# EAGLE design ROM16word (EAGLE 7.3.0)

## Sheet 1 of 2
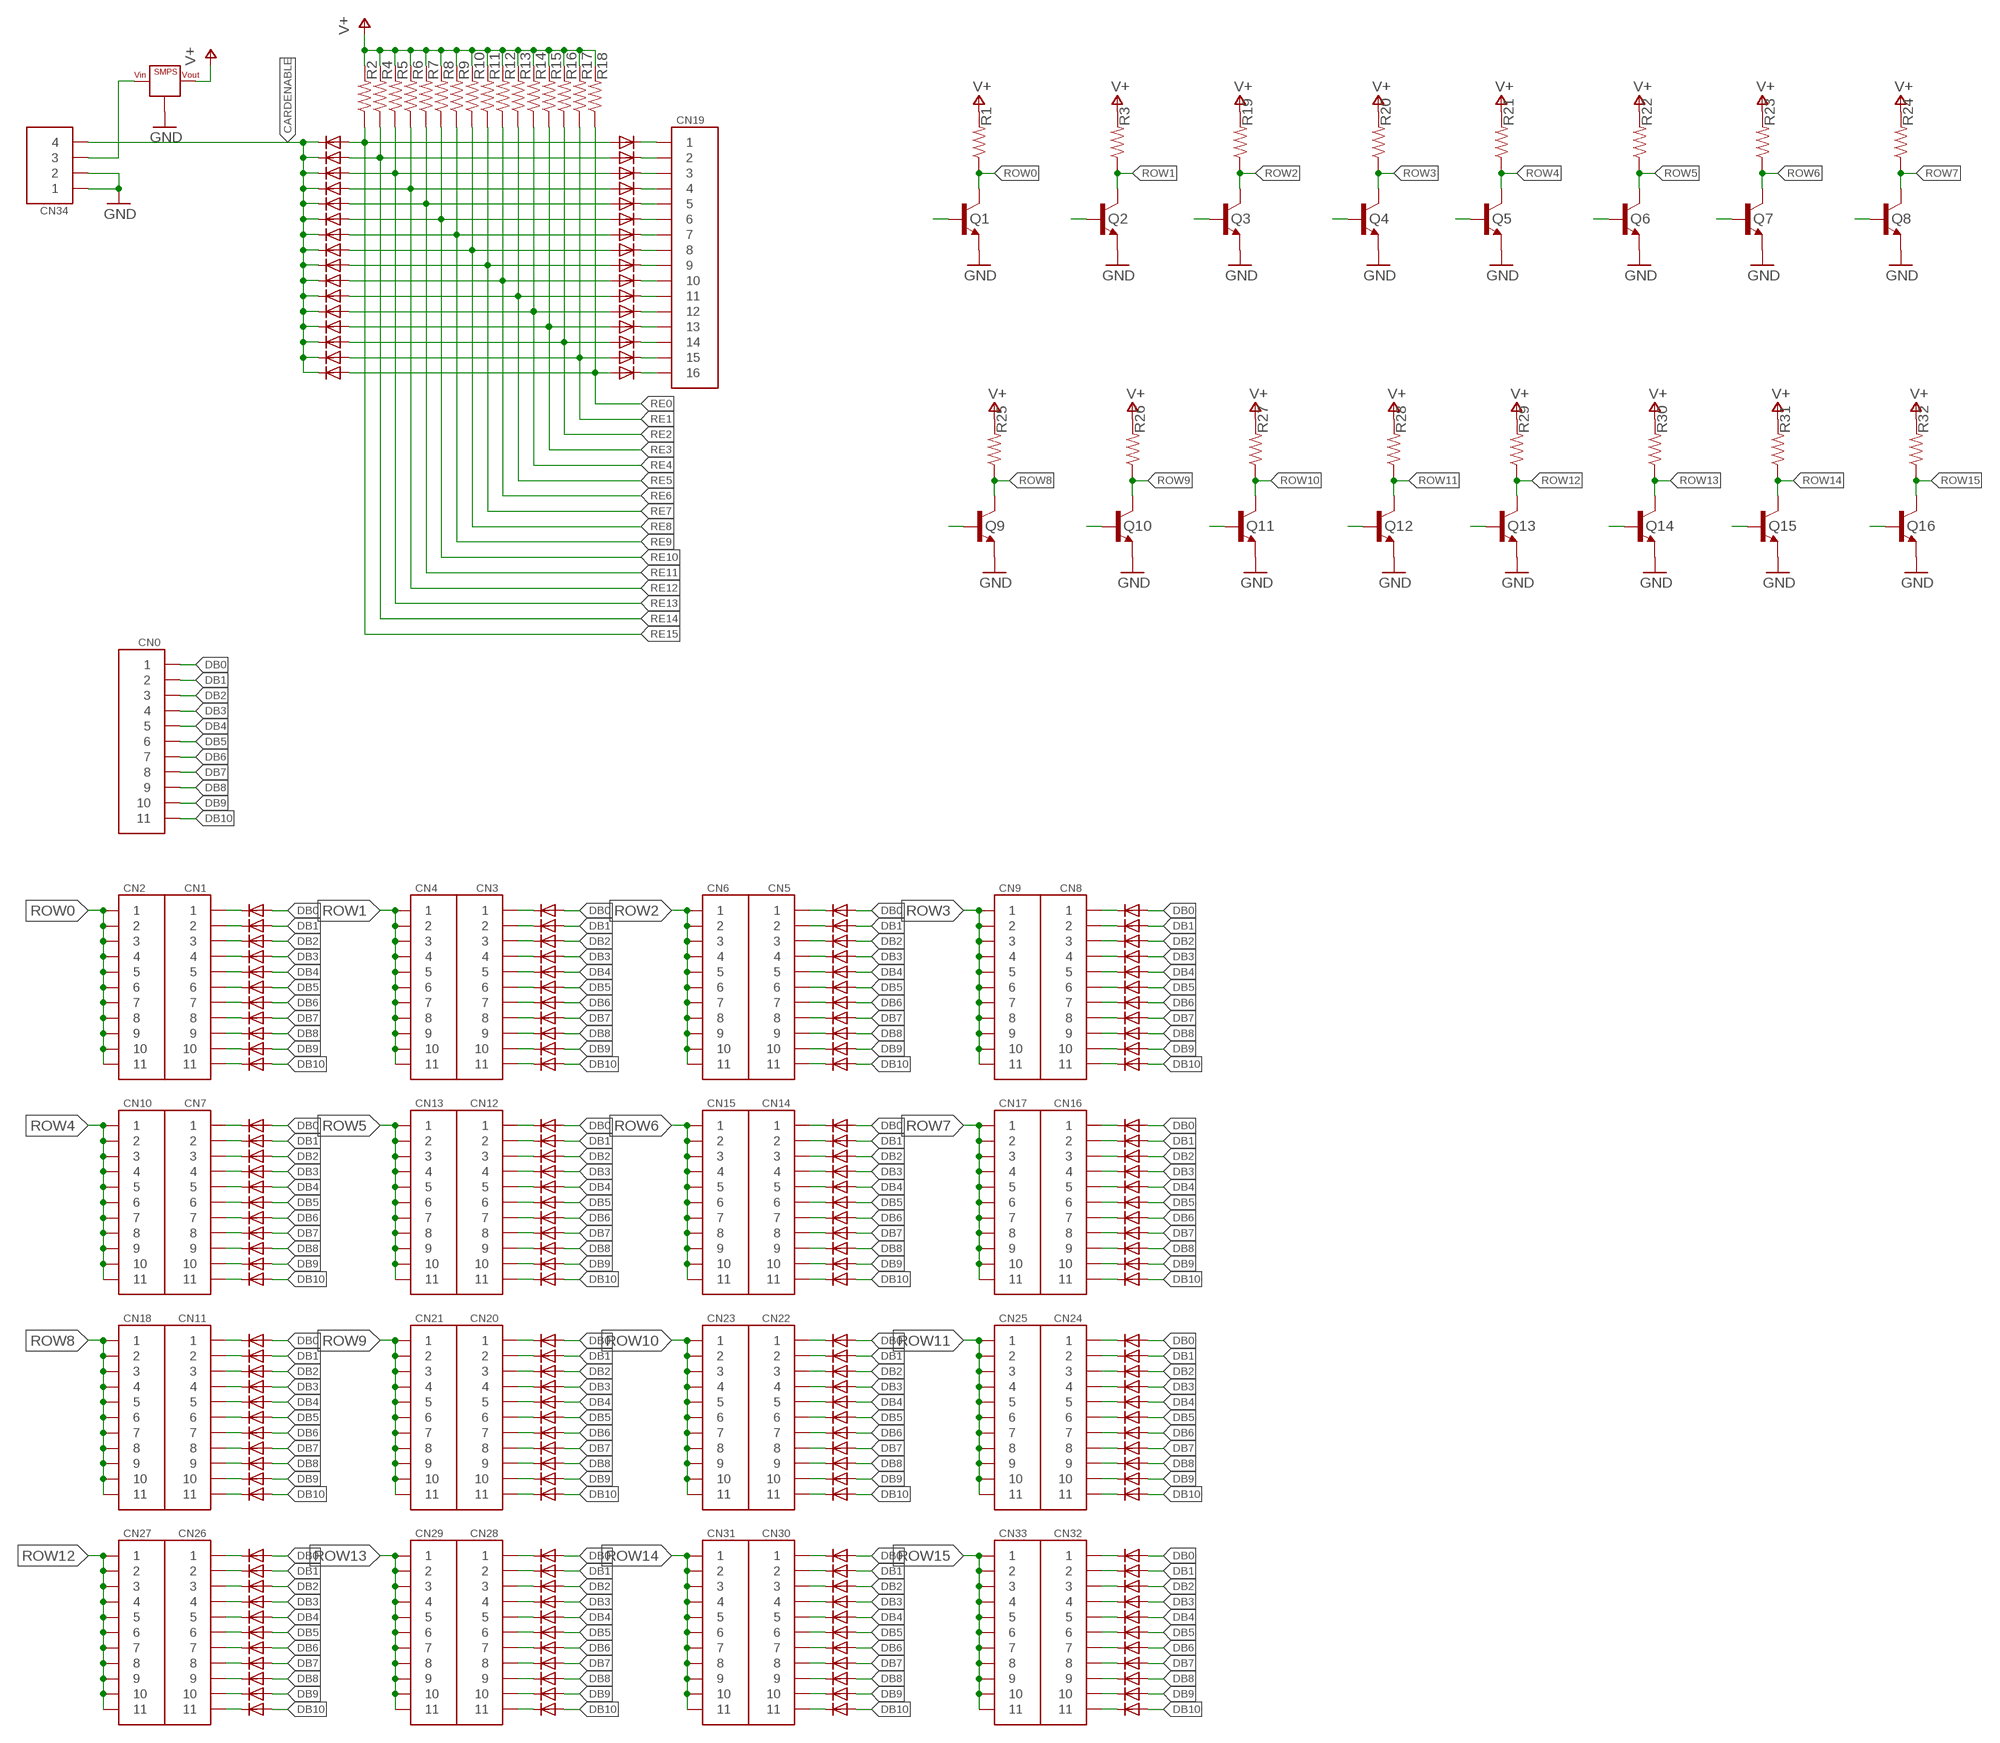
[diagram p0: schematic, sheet 1]

### Parts
CN0  HD11  [HD11]
CN1  HD11  [HD11]
CN2  HD11  [HD11]
CN3  HD11  [HD11]
CN4  HD11  [HD11]
CN5  HD11  [HD11]
CN6  HD11  [HD11]
CN7  HD11  [HD11]
CN8  HD11  [HD11]
CN9  HD11  [HD11]
CN10  HD11  [HD11]
CN11  HD11  [HD11]
CN12  HD11  [HD11]
CN13  HD11  [HD11]
CN14  HD11  [HD11]
CN15  HD11  [HD11]
CN16  HD11  [HD11]
CN17  HD11  [HD11]
CN18  HD11  [HD11]
CN19  HD16  [HD16]
CN20  HD11  [HD11]
CN21  HD11  [HD11]
CN22  HD11  [HD11]
CN23  HD11  [HD11]
CN24  HD11  [HD11]
CN25  HD11  [HD11]
CN26  HD11  [HD11]
CN27  HD11  [HD11]
CN28  HD11  [HD11]
CN29  HD11  [HD11]
CN30  HD11  [HD11]
CN31  HD11  [HD11]
CN32  HD11  [HD11]
CN33  HD11  [HD11]
CN34  HD4  [HD4]
D1  DIODE-6.3  [DO35-6.3]
D2  DIODE-6.3  [DO35-6.3]
D3  DIODE-6.3  [DO35-6.3]
D4  DIODE-6.3  [DO35-6.3]
D5  DIODE-6.3  [DO35-6.3]
D6  DIODE-6.3  [DO35-6.3]
D7  DIODE-6.3  [DO35-6.3]
D8  DIODE-6.3  [DO35-6.3]
D9  DIODE-6.3  [DO35-6.3]
D10  DIODE-6.3  [DO35-6.3]
D11  DIODE-6.3  [DO35-6.3]
D12  DIODE-6.3  [DO35-6.3]
D13  DIODE-6.3  [DO35-6.3]
D14  DIODE-6.3  [DO35-6.3]
D15  DIODE-6.3  [DO35-6.3]
D16  DIODE-6.3  [DO35-6.3]
D17  DIODE-6.3  [DO35-6.3]
D18  DIODE-6.3  [DO35-6.3]
D19  DIODE-6.3  [DO35-6.3]
D20  DIODE-6.3  [DO35-6.3]
D21  DIODE-6.3  [DO35-6.3]
D22  DIODE-6.3  [DO35-6.3]
D23  DIODE-6.3  [DO35-6.3]
D24  DIODE-6.3  [DO35-6.3]
D25  DIODE-6.3  [DO35-6.3]
D26  DIODE-6.3  [DO35-6.3]
D27  DIODE-6.3  [DO35-6.3]
D28  DIODE-6.3  [DO35-6.3]
D29  DIODE-6.3  [DO35-6.3]
D30  DIODE-6.3  [DO35-6.3]
D31  DIODE-6.3  [DO35-6.3]
D32  DIODE-6.3  [DO35-6.3]
D33  DIODE-6.3  [DO35-6.3]
D34  DIODE-6.3  [DO35-6.3]
D35  DIODE-6.3  [DO35-6.3]
D36  DIODE-6.3  [DO35-6.3]
D37  DIODE-6.3  [DO35-6.3]
D38  DIODE-6.3  [DO35-6.3]
D39  DIODE-6.3  [DO35-6.3]
D40  DIODE-6.3  [DO35-6.3]
D41  DIODE-6.3  [DO35-6.3]
D42  DIODE-6.3  [DO35-6.3]
D43  DIODE-6.3  [DO35-6.3]
D44  DIODE-6.3  [DO35-6.3]
D45  DIODE-6.3  [DO35-6.3]
D46  DIODE-6.3  [DO35-6.3]
D47  DIODE-6.3  [DO35-6.3]
D48  DIODE-6.3  [DO35-6.3]
D49  DIODE-6.3  [DO35-6.3]
D50  DIODE-6.3  [DO35-6.3]
D51  DIODE-6.3  [DO35-6.3]
D52  DIODE-6.3  [DO35-6.3]
D53  DIODE-6.3  [DO35-6.3]
D54  DIODE-6.3  [DO35-6.3]
D55  DIODE-6.3  [DO35-6.3]
D56  DIODE-6.3  [DO35-6.3]
D57  DIODE-6.3  [DO35-6.3]
D58  DIODE-6.3  [DO35-6.3]
D59  DIODE-6.3  [DO35-6.3]
D60  DIODE-6.3  [DO35-6.3]
D61  DIODE-6.3  [DO35-6.3]
D62  DIODE-6.3  [DO35-6.3]
D63  DIODE-6.3  [DO35-6.3]
D64  DIODE-6.3  [DO35-6.3]
D65  DIODE-6.3  [DO35-6.3]
D66  DIODE-6.3  [DO35-6.3]
D67  DIODE-6.3  [DO35-6.3]
D68  DIODE-6.3  [DO35-6.3]
D69  DIODE-6.3  [DO35-6.3]
D70  DIODE-6.3  [DO35-6.3]
D71  DIODE-6.3  [DO35-6.3]
D72  DIODE-6.3  [DO35-6.3]
D73  DIODE-6.3  [DO35-6.3]
D74  DIODE-6.3  [DO35-6.3]
D75  DIODE-6.3  [DO35-6.3]
D76  DIODE-6.3  [DO35-6.3]
D77  DIODE-6.3  [DO35-6.3]
D78  DIODE-6.3  [DO35-6.3]
D79  DIODE-6.3  [DO35-6.3]
D80  DIODE-6.3  [DO35-6.3]
D81  DIODE-6.3  [DO35-6.3]
D82  DIODE-6.3  [DO35-6.3]
D83  DIODE-6.3  [DO35-6.3]
D84  DIODE-6.3  [DO35-6.3]
D85  DIODE-6.3  [DO35-6.3]
D86  DIODE-6.3  [DO35-6.3]
D87  DIODE-6.3  [DO35-6.3]
D88  DIODE-6.3  [DO35-6.3]
D89  DIODE-6.3  [DO35-6.3]
D90  DIODE-6.3  [DO35-6.3]
D91  DIODE-6.3  [DO35-6.3]
D92  DIODE-6.3  [DO35-6.3]
D93  DIODE-6.3  [DO35-6.3]
D94  DIODE-6.3  [DO35-6.3]
D95  DIODE-6.3  [DO35-6.3]
D96  DIODE-6.3  [DO35-6.3]
D97  DIODE-6.3  [DO35-6.3]
D98  DIODE-6.3  [DO35-6.3]
D99  DIODE-6.3  [DO35-6.3]
D100  DIODE-6.3  [DO35-6.3]
D101  DIODE-6.3  [DO35-6.3]
D102  DIODE-6.3  [DO35-6.3]
D103  DIODE-6.3  [DO35-6.3]
D104  DIODE-6.3  [DO35-6.3]
D105  DIODE-6.3  [DO35-6.3]
D106  DIODE-6.3  [DO35-6.3]
D107  DIODE-6.3  [DO35-6.3]
D108  DIODE-6.3  [DO35-6.3]
D109  DIODE-6.3  [DO35-6.3]
D110  DIODE-6.3  [DO35-6.3]
D111  DIODE-6.3  [DO35-6.3]
D112  DIODE-6.3  [DO35-6.3]
D113  DIODE-6.3  [DO35-6.3]
D114  DIODE-6.3  [DO35-6.3]
D115  DIODE-6.3  [DO35-6.3]
D116  DIODE-6.3  [DO35-6.3]
D117  DIODE-6.3  [DO35-6.3]
D118  DIODE-6.3  [DO35-6.3]
D119  DIODE-6.3  [DO35-6.3]
D120  DIODE-6.3  [DO35-6.3]
D121  DIODE-6.3  [DO35-6.3]
D122  DIODE-6.3  [DO35-6.3]
D123  DIODE-6.3  [DO35-6.3]
D124  DIODE-6.3  [DO35-6.3]
D125  DIODE-6.3  [DO35-6.3]
D126  DIODE-6.3  [DO35-6.3]
D127  DIODE-6.3  [DO35-6.3]
D128  DIODE-6.3  [DO35-6.3]
D129  DIODE-6.3  [DO35-6.3]
D130  DIODE-6.3  [DO35-6.3]
D131  DIODE-6.3  [DO35-6.3]
D132  DIODE-6.3  [DO35-6.3]
D133  DIODE-6.3  [DO35-6.3]
D134  DIODE-6.3  [DO35-6.3]
D135  DIODE-6.3  [DO35-6.3]
D136  DIODE-6.3  [DO35-6.3]
D137  DIODE-6.3  [DO35-6.3]
D138  DIODE-6.3  [DO35-6.3]
D139  DIODE-6.3  [DO35-6.3]
D140  DIODE-6.3  [DO35-6.3]
D141  DIODE-6.3  [DO35-6.3]
D142  DIODE-6.3  [DO35-6.3]
D143  DIODE-6.3  [DO35-6.3]
D144  DIODE-6.3  [DO35-6.3]
D145  DIODE-6.3  [DO35-6.3]
D146  DIODE-6.3  [DO35-6.3]
D147  DIODE-6.3  [DO35-6.3]
D148  DIODE-6.3  [DO35-6.3]
D149  DIODE-6.3  [DO35-6.3]
D150  DIODE-6.3  [DO35-6.3]
D151  DIODE-6.3  [DO35-6.3]
D152  DIODE-6.3  [DO35-6.3]
D153  DIODE-6.3  [DO35-6.3]
D154  DIODE-6.3  [DO35-6.3]
D155  DIODE-6.3  [DO35-6.3]
D156  DIODE-6.3  [DO35-6.3]
D157  DIODE-6.3  [DO35-6.3]
D158  DIODE-6.3  [DO35-6.3]
D159  DIODE-6.3  [DO35-6.3]
D160  DIODE-6.3  [DO35-6.3]
D161  DIODE-6.3  [DO35-6.3]
D162  DIODE-6.3  [DO35-6.3]
D163  DIODE-6.3  [DO35-6.3]
D164  DIODE-6.3  [DO35-6.3]
D165  DIODE-6.3  [DO35-6.3]
D166  DIODE-6.3  [DO35-6.3]
D167  DIODE-6.3  [DO35-6.3]
D168  DIODE-6.3  [DO35-6.3]
D169  DIODE-6.3  [DO35-6.3]
D170  DIODE-6.3  [DO35-6.3]
D171  DIODE-6.3  [DO35-6.3]
D172  DIODE-6.3  [DO35-6.3]
D173  DIODE-6.3  [DO35-6.3]
D174  DIODE-6.3  [DO35-6.3]
D175  DIODE-6.3  [DO35-6.3]
D176  DIODE-6.3  [DO35-6.3]
D177  DIODE-5.08  [DO35-5.08]
D178  DIODE-5.08  [DO35-5.08]
D179  DIODE-5.08  [DO35-5.08]
D180  DIODE-5.08  [DO35-5.08]
D181  DIODE-5.08  [DO35-5.08]
D182  DIODE-5.08  [DO35-5.08]
D183  DIODE-5.08  [DO35-5.08]
D184  DIODE-5.08  [DO35-5.08]
D185  DIODE-5.08  [DO35-5.08]
D186  DIODE-5.08  [DO35-5.08]
D187  DIODE-5.08  [DO35-5.08]
D188  DIODE-5.08  [DO35-5.08]
D189  DIODE-5.08  [DO35-5.08]
D190  DIODE-5.08  [DO35-5.08]
D191  DIODE-5.08  [DO35-5.08]
D192  DIODE-5.08  [DO35-5.08]
D193  DIODE-5.08  [DO35-5.08]
D194  DIODE-5.08  [DO35-5.08]
D195  DIODE-5.08  [DO35-5.08]
D196  DIODE-5.08  [DO35-5.08]
D197  DIODE-5.08  [DO35-5.08]
D198  DIODE-5.08  [DO35-5.08]
D199  DIODE-5.08  [DO35-5.08]
D200  DIODE-5.08  [DO35-5.08]
D201  DIODE-5.08  [DO35-5.08]
D202  DIODE-5.08  [DO35-5.08]
D203  DIODE-5.08  [DO35-5.08]
D204  DIODE-5.08  [DO35-5.08]
D205  DIODE-5.08  [DO35-5.08]
D206  DIODE-5.08  [DO35-5.08]
D207  DIODE-5.08  [DO35-5.08]
D208  DIODE-5.08  [DO35-5.08]
Q1  BC547-STRAIGHT  [TO92-S-CBE]
Q2  BC547-STRAIGHT  [TO92-S-CBE]
Q3  BC547-STRAIGHT  [TO92-S-CBE]
Q4  BC547-STRAIGHT  [TO92-S-CBE]
Q5  BC547-STRAIGHT  [TO92-S-CBE]
Q6  BC547-STRAIGHT  [TO92-S-CBE]
Q7  BC547-STRAIGHT  [TO92-S-CBE]
Q8  BC547-STRAIGHT  [TO92-S-CBE]
Q9  BC547-STRAIGHT  [TO92-S-CBE]
Q10  BC547-STRAIGHT  [TO92-S-CBE]
Q11  BC547-STRAIGHT  [TO92-S-CBE]
Q12  BC547-STRAIGHT  [TO92-S-CBE]
Q13  BC547-STRAIGHT  [TO92-S-CBE]
Q14  BC547-STRAIGHT  [TO92-S-CBE]
Q15  BC547-STRAIGHT  [TO92-S-CBE]
Q16  BC547-STRAIGHT  [TO92-S-CBE]
R1  R1/8-6MM  [R0125-6.3]
R2  R1/8-6MM  [R0125-6.3]
R3  R1/8-6MM  [R0125-6.3]
R4  R1/8-6MM  [R0125-6.3]
R5  R1/8-6MM  [R0125-6.3]
R6  R1/8-6MM  [R0125-6.3]
R7  R1/8-6MM  [R0125-6.3]
R8  R1/8-6MM  [R0125-6.3]
R9  R1/8-6MM  [R0125-6.3]
R10  R1/8-6MM  [R0125-6.3]
R11  R1/8-6MM  [R0125-6.3]
R12  R1/8-6MM  [R0125-6.3]
R13  R1/8-6MM  [R0125-6.3]
R14  R1/8-6MM  [R0125-6.3]
R15  R1/8-6MM  [R0125-6.3]
R16  R1/8-6MM  [R0125-6.3]
R17  R1/8-6MM  [R0125-6.3]
R18  R1/8-6MM  [R0125-6.3]
R19  R1/8-6MM  [R0125-6.3]
R20  R1/8-6MM  [R0125-6.3]
R21  R1/8-6MM  [R0125-6.3]
R22  R1/8-6MM  [R0125-6.3]
R23  R1/8-6MM  [R0125-6.3]
R24  R1/8-6MM  [R0125-6.3]
R25  R1/8-6MM  [R0125-6.3]
R26  R1/8-6MM  [R0125-6.3]
R27  R1/8-6MM  [R0125-6.3]
R28  R1/8-6MM  [R0125-6.3]
R29  R1/8-6MM  [R0125-6.3]
R30  R1/8-6MM  [R0125-6.3]
R31  R1/8-6MM  [R0125-6.3]
R32  R1/8-6MM  [R0125-6.3]
VR1  SMPS  [BUCK1722]

### Nets
CARDENABLE: CN34.P$4 D182.C D183.C D184.C D185.C D186.C D187.C D188.C D189.C D190.C D191.C D192.C D193.C D194.C D195.C D196.C D197.C
DB0: CN0.P$1 D1.A D12.A D23.A D34.A D45.A D56.A D67.A D78.A D89.A D100.A D111.A D122.A D133.A D144.A D155.A D166.A
DB1: CN0.P$2 D2.A D13.A D24.A D35.A D46.A D57.A D68.A D79.A D90.A D101.A D112.A D123.A D134.A D145.A D156.A D167.A
DB2: CN0.P$3 D3.A D14.A D25.A D36.A D47.A D58.A D69.A D80.A D91.A D102.A D113.A D124.A D135.A D146.A D157.A D168.A
DB3: CN0.P$4 D4.A D15.A D26.A D37.A D48.A D59.A D70.A D81.A D92.A D103.A D114.A D125.A D136.A D147.A D158.A D169.A
DB4: CN0.P$5 D5.A D16.A D27.A D38.A D49.A D60.A D71.A D82.A D93.A D104.A D115.A D126.A D137.A D148.A D159.A D170.A
DB5: CN0.P$6 D6.A D17.A D28.A D39.A D50.A D61.A D72.A D83.A D94.A D105.A D116.A D127.A D138.A D149.A D160.A D171.A
DB6: CN0.P$7 D7.A D18.A D29.A D40.A D51.A D62.A D73.A D84.A D95.A D106.A D117.A D128.A D139.A D150.A D161.A D172.A
DB7: CN0.P$8 D8.A D19.A D30.A D41.A D52.A D63.A D74.A D85.A D96.A D107.A D118.A D129.A D140.A D151.A D162.A D173.A
DB8: CN0.P$9 D9.A D20.A D31.A D42.A D53.A D64.A D75.A D86.A D97.A D108.A D119.A D130.A D141.A D152.A D163.A D174.A
DB9: CN0.P$10 D10.A D21.A D32.A D43.A D54.A D65.A D76.A D87.A D98.A D109.A D120.A D131.A D142.A D153.A D164.A D175.A
DB10: CN0.P$11 D11.A D22.A D33.A D44.A D55.A D66.A D77.A D88.A D99.A D110.A D121.A D132.A D143.A D154.A D165.A D176.A
GND: CN34.P$1 CN34.P$2 Q1.E Q2.E Q3.E Q4.E Q5.E Q6.E Q7.E Q8.E Q9.E Q10.E Q11.E Q12.E Q13.E Q14.E Q15.E Q16.E VR1.GND@1(GND) VR1.GND@2(GND) VR1.GND@3(GND) VR1.GND@4(GND)
N$1: CN1.P$1 D1.C
N$2: CN1.P$2 D2.C
N$3: CN1.P$3 D3.C
N$4: CN1.P$4 D4.C
N$5: CN1.P$5 D5.C
N$6: CN1.P$6 D6.C
N$7: CN1.P$7 D7.C
N$8: CN1.P$8 D8.C
N$9: CN1.P$9 D9.C
N$10: CN1.P$10 D10.C
N$11: CN1.P$11 D11.C
N$12: CN3.P$1 D12.C
N$13: CN3.P$2 D13.C
N$14: CN3.P$3 D14.C
N$15: CN3.P$4 D15.C
N$16: CN3.P$5 D16.C
N$17: CN3.P$6 D17.C
N$18: CN3.P$7 D18.C
N$19: CN3.P$8 D19.C
N$20: CN3.P$9 D20.C
N$21: CN3.P$10 D21.C
N$22: CN3.P$11 D22.C
N$23: CN5.P$1 D23.C
N$24: CN5.P$2 D24.C
N$25: CN5.P$3 D25.C
N$26: CN5.P$4 D26.C
N$27: CN5.P$5 D27.C
N$28: CN5.P$6 D28.C
N$29: CN5.P$7 D29.C
N$30: CN5.P$8 D30.C
N$31: CN5.P$9 D31.C
N$32: CN5.P$10 D32.C
N$33: CN5.P$11 D33.C
N$34: CN8.P$1 D34.C
N$35: CN8.P$2 D35.C
N$36: CN8.P$3 D36.C
N$37: CN8.P$4 D37.C
N$38: CN8.P$5 D38.C
N$39: CN8.P$6 D39.C
N$40: CN8.P$7 D40.C
N$41: CN8.P$8 D41.C
N$42: CN8.P$9 D42.C
N$43: CN8.P$10 D43.C
N$44: CN8.P$11 D44.C
N$45: CN7.P$1 D45.C
N$46: CN7.P$2 D46.C
N$47: CN7.P$3 D47.C
N$48: CN7.P$4 D48.C
N$49: CN7.P$5 D49.C
N$50: CN7.P$6 D50.C
N$51: CN7.P$7 D51.C
N$52: CN7.P$8 D52.C
N$53: CN7.P$9 D53.C
N$54: CN7.P$10 D54.C
N$55: CN7.P$11 D55.C
N$56: CN12.P$1 D56.C
N$57: CN12.P$2 D57.C
N$58: CN12.P$3 D58.C
N$59: CN12.P$4 D59.C
N$60: CN12.P$5 D60.C
N$61: CN12.P$6 D61.C
N$62: CN12.P$7 D62.C
N$63: CN12.P$8 D63.C
N$64: CN12.P$9 D64.C
N$65: CN12.P$10 D65.C
N$66: CN12.P$11 D66.C
N$67: CN14.P$1 D67.C
N$68: CN14.P$2 D68.C
N$69: CN14.P$3 D69.C
N$70: CN14.P$4 D70.C
N$71: CN14.P$5 D71.C
N$72: CN14.P$6 D72.C
N$73: CN14.P$7 D73.C
N$74: CN14.P$8 D74.C
N$75: CN14.P$9 D75.C
N$76: CN14.P$10 D76.C
N$77: CN14.P$11 D77.C
N$78: CN16.P$1 D78.C
N$79: CN16.P$2 D79.C
N$80: CN16.P$3 D80.C
N$81: CN16.P$4 D81.C
N$82: CN16.P$5 D82.C
N$83: CN16.P$6 D83.C
N$84: CN16.P$7 D84.C
N$85: CN16.P$8 D85.C
N$86: CN16.P$9 D86.C
N$87: CN16.P$10 D87.C
N$88: CN16.P$11 D88.C
N$89: CN11.P$1 D89.C
N$90: CN11.P$2 D90.C
N$91: CN11.P$3 D91.C
N$92: CN11.P$4 D92.C
N$93: CN11.P$5 D93.C
N$94: CN11.P$6 D94.C
N$95: CN11.P$7 D95.C
N$96: CN11.P$8 D96.C
N$97: CN11.P$9 D97.C
N$98: CN11.P$10 D98.C
N$99: CN11.P$11 D99.C
N$100: CN20.P$1 D100.C
N$101: CN20.P$2 D101.C
N$102: CN20.P$3 D102.C
N$103: CN20.P$4 D103.C
N$104: CN20.P$5 D104.C
N$105: CN20.P$6 D105.C
N$106: CN20.P$7 D106.C
N$107: CN20.P$8 D107.C
N$108: CN20.P$9 D108.C
N$109: CN20.P$10 D109.C
N$110: CN20.P$11 D110.C
N$111: CN22.P$1 D111.C
N$112: CN22.P$2 D112.C
N$113: CN22.P$3 D113.C
N$114: CN22.P$4 D114.C
N$115: CN22.P$5 D115.C
N$116: CN22.P$6 D116.C
N$117: CN22.P$7 D117.C
N$118: CN22.P$8 D118.C
N$119: CN22.P$9 D119.C
N$120: CN22.P$10 D120.C
N$121: CN22.P$11 D121.C
N$122: CN24.P$1 D122.C
N$123: CN24.P$2 D123.C
N$124: CN24.P$3 D124.C
N$125: CN24.P$4 D125.C
N$126: CN24.P$5 D126.C
N$127: CN24.P$6 D127.C
N$128: CN24.P$7 D128.C
N$129: CN24.P$8 D129.C
N$130: CN24.P$9 D130.C
N$131: CN24.P$10 D131.C
N$132: CN24.P$11 D132.C
N$133: CN26.P$1 D133.C
N$134: CN26.P$2 D134.C
N$135: CN26.P$3 D135.C
N$136: CN26.P$4 D136.C
N$137: CN26.P$5 D137.C
N$138: CN26.P$6 D138.C
N$139: CN26.P$7 D139.C
N$140: CN26.P$8 D140.C
N$141: CN26.P$9 D141.C
N$142: CN26.P$10 D142.C
N$143: CN26.P$11 D143.C
N$144: CN28.P$1 D144.C
N$145: CN28.P$2 D145.C
N$146: CN28.P$3 D146.C
N$147: CN28.P$4 D147.C
N$148: CN28.P$5 D148.C
N$149: CN28.P$6 D149.C
N$150: CN28.P$7 D150.C
N$151: CN28.P$8 D151.C
N$152: CN28.P$9 D152.C
N$153: CN28.P$10 D153.C
N$154: CN28.P$11 D154.C
N$155: CN30.P$1 D155.C
N$156: CN30.P$2 D156.C
N$157: CN30.P$3 D157.C
N$158: CN30.P$4 D158.C
N$159: CN30.P$5 D159.C
N$160: CN30.P$6 D160.C
N$161: CN30.P$7 D161.C
N$162: CN30.P$8 D162.C
N$163: CN30.P$9 D163.C
N$164: CN30.P$10 D164.C
N$165: CN30.P$11 D165.C
N$166: CN32.P$1 D166.C
N$167: CN32.P$2 D167.C
N$168: CN32.P$3 D168.C
N$169: CN32.P$4 D169.C
N$170: CN32.P$5 D170.C
N$171: CN32.P$6 D171.C
N$172: CN32.P$7 D172.C
N$173: CN32.P$8 D173.C
N$174: CN32.P$9 D174.C
N$175: CN32.P$10 D175.C
N$176: CN32.P$11 D176.C
N$177: Q2.B
N$178: Q1.B
N$179: Q3.B
N$180: Q4.B
N$181: Q5.B
N$182: Q6.B
N$183: Q7.B
N$184: Q8.B
N$185: Q9.B
N$186: Q10.B
N$187: Q11.B
N$188: Q12.B
N$189: Q13.B
N$190: Q14.B
N$191: Q15.B
N$192: Q16.B
POW: CN34.P$3 VR1.IN@1(VIN) VR1.IN@2(VIN)
RE0: D197.A D208.A R18.1
RE1: D196.A D207.A R17.1
RE2: D195.A D206.A R16.1
RE3: D194.A D205.A R15.1
RE4: D193.A D204.A R14.1
RE5: D192.A D203.A R13.1
RE6: D191.A D202.A R12.1
RE7: D190.A D201.A R11.1
RE8: D189.A D200.A R10.1
RE9: D188.A D199.A R9.1
RE10: D187.A D198.A R8.1
RE11: D181.A D186.A R7.1
RE12: D180.A D185.A R6.1
RE13: D179.A D184.A R5.1
RE14: D178.A D183.A R4.1
RE15: D177.A D182.A R2.1
ROW0: CN2.P$1 CN2.P$2 CN2.P$3 CN2.P$4 CN2.P$5 CN2.P$6 CN2.P$7 CN2.P$8 CN2.P$9 CN2.P$10 CN2.P$11 Q1.C R1.1
ROW1: CN4.P$1 CN4.P$2 CN4.P$3 CN4.P$4 CN4.P$5 CN4.P$6 CN4.P$7 CN4.P$8 CN4.P$9 CN4.P$10 CN4.P$11 Q2.C R3.1
ROW2: CN6.P$1 CN6.P$2 CN6.P$3 CN6.P$4 CN6.P$5 CN6.P$6 CN6.P$7 CN6.P$8 CN6.P$9 CN6.P$10 CN6.P$11 Q3.C R19.1
ROW3: CN9.P$1 CN9.P$2 CN9.P$3 CN9.P$4 CN9.P$5 CN9.P$6 CN9.P$7 CN9.P$8 CN9.P$9 CN9.P$10 CN9.P$11 Q4.C R20.1
ROW4: CN10.P$1 CN10.P$2 CN10.P$3 CN10.P$4 CN10.P$5 CN10.P$6 CN10.P$7 CN10.P$8 CN10.P$9 CN10.P$10 CN10.P$11 Q5.C R21.1
ROW5: CN13.P$1 CN13.P$2 CN13.P$3 CN13.P$4 CN13.P$5 CN13.P$6 CN13.P$7 CN13.P$8 CN13.P$9 CN13.P$10 CN13.P$11 Q6.C R22.1
ROW6: CN15.P$1 CN15.P$2 CN15.P$3 CN15.P$4 CN15.P$5 CN15.P$6 CN15.P$7 CN15.P$8 CN15.P$9 CN15.P$10 CN15.P$11 Q7.C R23.1
ROW7: CN17.P$1 CN17.P$2 CN17.P$3 CN17.P$4 CN17.P$5 CN17.P$6 CN17.P$7 CN17.P$8 CN17.P$9 CN17.P$10 CN17.P$11 Q8.C R24.1
ROW8: CN18.P$1 CN18.P$2 CN18.P$3 CN18.P$4 CN18.P$5 CN18.P$6 CN18.P$7 CN18.P$8 CN18.P$9 CN18.P$10 CN18.P$11 Q9.C R25.1
ROW9: CN21.P$1 CN21.P$2 CN21.P$3 CN21.P$4 CN21.P$5 CN21.P$6 CN21.P$7 CN21.P$8 CN21.P$9 CN21.P$10 CN21.P$11 Q10.C R26.1
ROW10: CN23.P$1 CN23.P$2 CN23.P$3 CN23.P$4 CN23.P$5 CN23.P$6 CN23.P$7 CN23.P$8 CN23.P$9 CN23.P$10 CN23.P$11 Q11.C R27.1
ROW11: CN25.P$1 CN25.P$2 CN25.P$3 CN25.P$4 CN25.P$5 CN25.P$6 CN25.P$7 CN25.P$8 CN25.P$9 CN25.P$10 CN25.P$11 Q12.C R28.1
ROW12: CN27.P$1 CN27.P$2 CN27.P$3 CN27.P$4 CN27.P$5 CN27.P$6 CN27.P$7 CN27.P$8 CN27.P$9 CN27.P$10 CN27.P$11 Q13.C R29.1
ROW13: CN29.P$1 CN29.P$2 CN29.P$3 CN29.P$4 CN29.P$5 CN29.P$6 CN29.P$7 CN29.P$8 CN29.P$9 CN29.P$10 CN29.P$11 Q14.C R30.1
ROW14: CN31.P$1 CN31.P$2 CN31.P$3 CN31.P$4 CN31.P$5 CN31.P$6 CN31.P$7 CN31.P$8 CN31.P$9 CN31.P$10 CN31.P$11 Q15.C R31.1
ROW15: CN33.P$1 CN33.P$2 CN33.P$3 CN33.P$4 CN33.P$5 CN33.P$6 CN33.P$7 CN33.P$8 CN33.P$9 CN33.P$10 CN33.P$11 Q16.C R32.1
SEL0: CN19.P$1 D177.C
SEL1: CN19.P$2 D178.C
SEL2: CN19.P$3 D179.C
SEL3: CN19.P$4 D180.C
SEL4: CN19.P$5 D181.C
SEL5: CN19.P$6 D198.C
SEL6: CN19.P$7 D199.C
SEL7: CN19.P$8 D200.C
SEL8: CN19.P$9 D201.C
SEL9: CN19.P$10 D202.C
SEL10: CN19.P$11 D203.C
SEL11: CN19.P$12 D204.C
SEL12: CN19.P$13 D205.C
SEL13: CN19.P$14 D206.C
SEL14: CN19.P$15 D207.C
SEL15: CN19.P$16 D208.C
V+: R1.2 R2.2 R3.2 R4.2 R5.2 R6.2 R7.2 R8.2 R9.2 R10.2 R11.2 R12.2 R13.2 R14.2 R15.2 R16.2 R17.2 R18.2 R19.2 R20.2 R21.2 R22.2 R23.2 R24.2 R25.2 R26.2 R27.2 R28.2 R29.2 R30.2 R31.2 R32.2 VR1.OUT@1(VOUT) VR1.OUT@2(VOUT)

## Sheet 2 of 2

## Library data of the parts
CN0 CN1-CN18 CN20-CN33 = SmallRoomLabs_ConSwitch:HD11
CN19 = SmallRoomLabs_ConSwitch:HD16
CN34 = SmallRoomLabs_ConSwitch:HD4
D1-D208 = SmallRoomLabs_Semiconductor:DIODE
Q1-Q16 = SmallRoomLabs_Semiconductor:BC547
R1-R32 = SmallRoomLabs_Discrete:R
VR1 = SmallRoomLabs_Battery:SMPS

## Board
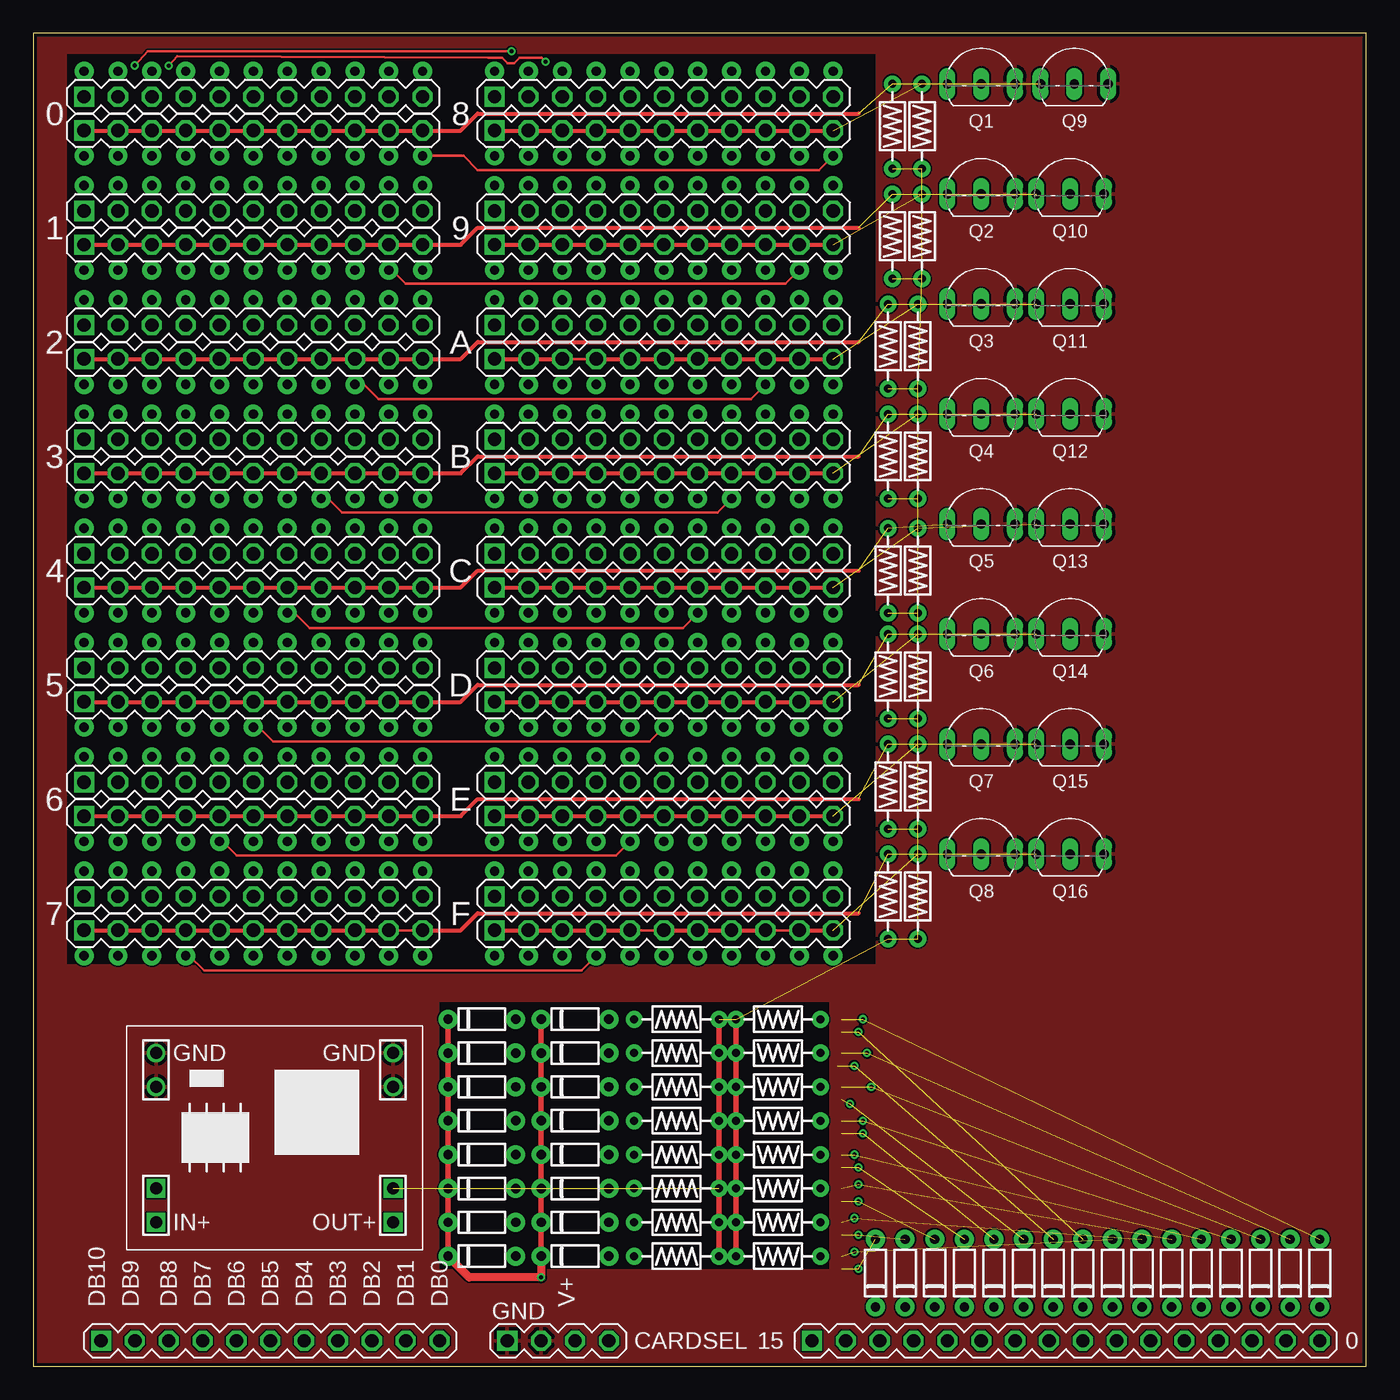
[diagram p1: board, top side]
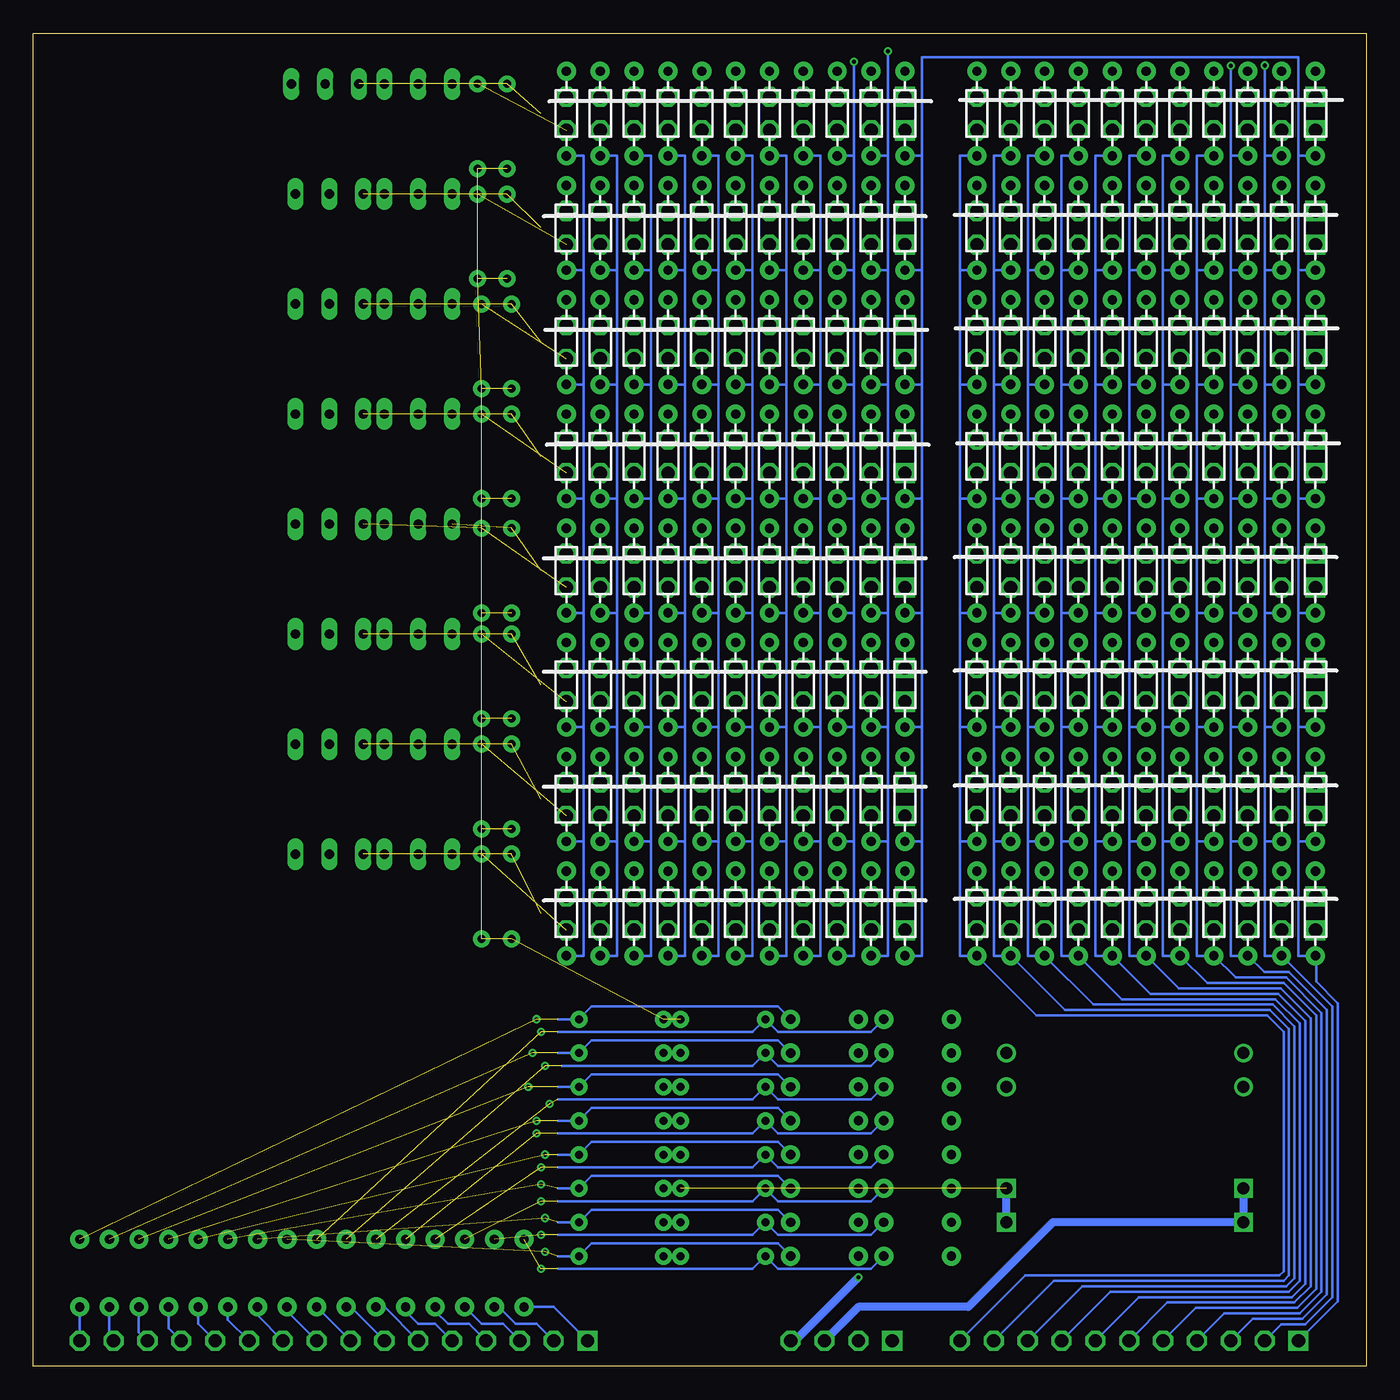
[diagram p2: board, bottom side, seen from below]

Size 100 x 100 mm. Coordinates in mm from the lower left corner, seen from the top.
Outline: 0,0 100,0 100,100 0,100 0,0
Copper layers (1*16): Top 0.035mm / dielectric 1.5mm / Bottom 0.035mm
Design rules "dirt_cheap_dirty_boards.v1": minimum track width 5mil, minimum drill 12mil, track to track 5mil, track to pad 5mil, pad to pad 5mil, via to via 5mil, smd to smd 0mil, copper to edge 10mil, drill to drill 10mil, minimum pad ring 10mil, minimum via ring 6mil, stop-mask expansion 2mil, vias tented up to drill 25mil, thermal gap 10mil
tRestrict: area 2.5,30.2 to 63.2,98.4; area 30.5,7.3 to 59.7,27.3

### Footprints (pad centres in the part's own frame; a part is rotated, then mirrored left to right if it is on the bottom)
HD11 = drill 1 square: P$1 -12.7,0 | drill 1 octagon: P$2 -10.16,0; P$3 -7.62,0; P$4 -5.08,0; P$5 -2.54,0; P$6 0,0; P$7 2.54,0; P$8 5.08,0; P$9 7.62,0; P$10 10.16,0; P$11 12.7,0
HD16 = drill 1 square: P$1 -19.05,0 | drill 1 octagon: P$2 -16.51,0; P$3 -13.97,0; P$4 -11.43,0; P$5 -8.89,0; P$6 -6.35,0; P$7 -3.81,0; P$8 -1.27,0; P$9 1.27,0; P$10 3.81,0; P$11 6.35,0; P$12 8.89,0; P$13 11.43,0; P$14 13.97,0; P$15 16.51,0; P$16 19.05,0
HD4 = drill 1 square: P$1 -3.81,0 | drill 1 octagon: P$2 -1.27,0; P$3 1.27,0; P$4 3.81,0
DO35-6.3 = drill 0.7 pad 1.422: A -3.175,0; C 3.175,0
DO35-5.08 = drill 0.7 pad 1.422: A -2.54,0; C 2.54,0
TO92-S-CBE = drill 0.7 long: B 0,0; C -2.54,0; E 2.54,0
R0125-6.3 = drill 0.6 pad 1.27: 1 -3.175,0; 2 3.175,0
BUCK1722 = drill 0.9: GND@1 -8.89,6.35; GND@2 -8.89,3.81; GND@3 8.89,6.35; GND@4 8.89,3.81 | drill 0.9 square: IN@1 -8.89,-3.81; IN@2 -8.89,-6.35; OUT@1 8.89,-3.81; OUT@2 8.89,-6.35

### Placement (x,y rotation side)
CN0  17.78,1.91 0 top
CN1  16.51,95.25 0 top
CN2  16.51,92.71 0 top
CN3  16.51,86.68 0 top
CN4  16.51,84.14 0 top
CN5  16.51,78.11 0 top
CN6  16.51,75.56 0 top
CN7  16.51,60.96 0 top
CN8  16.51,69.53 0 top
CN9  16.51,66.99 0 top
CN10  16.51,58.42 0 top
CN11  47.31,95.25 0 top
CN12  16.51,52.39 0 top
CN13  16.51,49.85 0 top
CN14  16.51,43.81 0 top
CN15  16.51,41.27 0 top
CN16  16.51,35.24 0 top
CN17  16.51,32.7 0 top
CN18  47.31,92.71 0 top
CN19  77.47,1.91 0 top
CN20  47.31,86.68 0 top
CN21  47.31,84.14 0 top
CN22  47.31,78.11 0 top
CN23  47.31,75.56 0 top
CN24  47.31,69.53 0 top
CN25  47.31,66.99 0 top
CN26  47.31,60.96 0 top
CN27  47.31,58.42 0 top
CN28  47.31,52.39 0 top
CN29  47.31,49.85 0 top
CN30  47.31,43.81 0 top
CN31  47.31,41.27 0 top
CN32  47.31,35.24 0 top
CN33  47.31,32.7 0 top
CN34  39.37,1.91 0 top
D1  3.81,93.98 90 bottom
D2  6.35,93.98 90 bottom
D3  8.89,93.98 90 bottom
D4  11.43,93.98 90 bottom
D5  13.97,93.98 90 bottom
D6  16.51,93.98 90 bottom
D7  19.05,93.98 90 bottom
D8  21.59,93.98 90 bottom
D9  24.13,93.98 90 bottom
D10  26.67,93.98 90 bottom
D11  29.21,93.98 90 bottom
D12  3.81,85.41 90 bottom
D13  6.35,85.41 90 bottom
D14  8.89,85.41 90 bottom
D15  11.43,85.41 90 bottom
D16  13.97,85.41 90 bottom
D17  16.51,85.41 90 bottom
D18  19.05,85.41 90 bottom
D19  21.59,85.41 90 bottom
D20  24.13,85.41 90 bottom
D21  26.67,85.41 90 bottom
D22  29.21,85.41 90 bottom
D23  3.81,76.83 90 bottom
D24  6.35,76.83 90 bottom
D25  8.89,76.83 90 bottom
D26  11.43,76.83 90 bottom
D27  13.97,76.83 90 bottom
D28  16.51,76.83 90 bottom
D29  19.05,76.83 90 bottom
D30  21.59,76.83 90 bottom
D31  24.13,76.83 90 bottom
D32  26.67,76.83 90 bottom
D33  29.21,76.83 90 bottom
D34  3.81,68.26 90 bottom
D35  6.35,68.26 90 bottom
D36  8.89,68.26 90 bottom
D37  11.43,68.26 90 bottom
D38  13.97,68.26 90 bottom
D39  16.51,68.26 90 bottom
D40  19.05,68.26 90 bottom
D41  21.59,68.26 90 bottom
D42  24.13,68.26 90 bottom
D43  26.67,68.26 90 bottom
D44  29.21,68.26 90 bottom
D45  3.81,59.69 90 bottom
D46  6.35,59.69 90 bottom
D47  8.89,59.69 90 bottom
D48  11.43,59.69 90 bottom
D49  13.97,59.69 90 bottom
D50  16.51,59.69 90 bottom
D51  19.05,59.69 90 bottom
D52  21.59,59.69 90 bottom
D53  24.13,59.69 90 bottom
D54  26.67,59.69 90 bottom
D55  29.21,59.69 90 bottom
D56  3.81,51.12 90 bottom
D57  6.35,51.12 90 bottom
D58  8.89,51.12 90 bottom
D59  11.43,51.12 90 bottom
D60  13.97,51.12 90 bottom
D61  16.51,51.12 90 bottom
D62  19.05,51.12 90 bottom
D63  21.59,51.12 90 bottom
D64  24.13,51.12 90 bottom
D65  26.67,51.12 90 bottom
D66  29.21,51.12 90 bottom
D67  3.81,42.55 90 bottom
D68  6.35,42.55 90 bottom
D69  8.89,42.55 90 bottom
D70  11.43,42.55 90 bottom
D71  13.97,42.55 90 bottom
D72  16.51,42.55 90 bottom
D73  19.05,42.55 90 bottom
D74  21.59,42.55 90 bottom
D75  24.13,42.55 90 bottom
D76  26.67,42.55 90 bottom
D77  29.21,42.55 90 bottom
D78  3.81,33.97 90 bottom
D79  6.35,33.97 90 bottom
D80  8.89,33.97 90 bottom
D81  11.43,33.97 90 bottom
D82  13.97,33.97 90 bottom
D83  16.51,33.97 90 bottom
D84  19.05,33.97 90 bottom
D85  21.59,33.97 90 bottom
D86  24.13,33.97 90 bottom
D87  26.67,33.97 90 bottom
D88  29.21,33.97 90 bottom
D89  34.61,93.98 90 bottom
D90  37.15,93.98 90 bottom
D91  39.69,93.98 90 bottom
D92  42.23,93.98 90 bottom
D93  44.77,93.98 90 bottom
D94  47.31,93.98 90 bottom
D95  49.85,93.98 90 bottom
D96  52.39,93.98 90 bottom
D97  54.93,93.98 90 bottom
D98  57.47,93.98 90 bottom
D99  60.01,93.98 90 bottom
D100  34.61,85.41 90 bottom
D101  37.15,85.41 90 bottom
D102  39.69,85.41 90 bottom
D103  42.23,85.41 90 bottom
D104  44.77,85.41 90 bottom
D105  47.31,85.41 90 bottom
D106  49.85,85.41 90 bottom
D107  52.39,85.41 90 bottom
D108  54.93,85.41 90 bottom
D109  57.47,85.41 90 bottom
D110  60.01,85.41 90 bottom
D111  34.61,76.83 90 bottom
D112  37.15,76.83 90 bottom
D113  39.69,76.83 90 bottom
D114  42.23,76.83 90 bottom
D115  44.77,76.83 90 bottom
D116  47.31,76.83 90 bottom
D117  49.85,76.83 90 bottom
D118  52.39,76.83 90 bottom
D119  54.93,76.83 90 bottom
D120  57.47,76.83 90 bottom
D121  60.01,76.83 90 bottom
D122  34.61,68.26 90 bottom
D123  37.15,68.26 90 bottom
D124  39.69,68.26 90 bottom
D125  42.23,68.26 90 bottom
D126  44.77,68.26 90 bottom
D127  47.31,68.26 90 bottom
D128  49.85,68.26 90 bottom
D129  52.39,68.26 90 bottom
D130  54.93,68.26 90 bottom
D131  57.47,68.26 90 bottom
D132  60.01,68.26 90 bottom
D133  34.61,59.69 90 bottom
D134  37.15,59.69 90 bottom
D135  39.69,59.69 90 bottom
D136  42.23,59.69 90 bottom
D137  44.77,59.69 90 bottom
D138  47.31,59.69 90 bottom
D139  49.85,59.69 90 bottom
D140  52.39,59.69 90 bottom
D141  54.93,59.69 90 bottom
D142  57.47,59.69 90 bottom
D143  60.01,59.69 90 bottom
D144  34.61,51.12 90 bottom
D145  37.15,51.12 90 bottom
D146  39.69,51.12 90 bottom
D147  42.23,51.12 90 bottom
D148  44.77,51.12 90 bottom
D149  47.31,51.12 90 bottom
D150  49.85,51.12 90 bottom
D151  52.39,51.12 90 bottom
D152  54.93,51.12 90 bottom
D153  57.47,51.12 90 bottom
D154  60.01,51.12 90 bottom
D155  34.61,42.55 90 bottom
D156  37.15,42.55 90 bottom
D157  39.69,42.55 90 bottom
D158  42.23,42.55 90 bottom
D159  44.77,42.55 90 bottom
D160  47.31,42.55 90 bottom
D161  49.85,42.55 90 bottom
D162  52.39,42.55 90 bottom
D163  54.93,42.55 90 bottom
D164  57.47,42.55 90 bottom
D165  60.01,42.55 90 bottom
D166  34.61,33.97 90 bottom
D167  37.15,33.97 90 bottom
D168  39.69,33.97 90 bottom
D169  42.23,33.97 90 bottom
D170  44.77,33.97 90 bottom
D171  47.31,33.97 90 bottom
D172  49.85,33.97 90 bottom
D173  52.39,33.97 90 bottom
D174  54.93,33.97 90 bottom
D175  57.47,33.97 90 bottom
D176  60.01,33.97 90 bottom
D177  63.18,6.99 270 top
D178  65.41,6.99 270 top
D179  67.63,6.99 270 top
D180  69.85,6.99 270 top
D181  72.07,6.99 270 top
D182  33.66,8.26 180 top
D183  33.66,10.79 180 top
D184  33.66,13.34 180 top
D185  33.66,15.88 180 top
D186  33.66,18.41 180 top
D187  33.66,20.95 180 top
D188  33.66,23.5 180 top
D189  33.66,26.04 180 top
D190  40.64,8.26 180 top
D191  40.64,10.79 180 top
D192  40.64,13.34 180 top
D193  40.64,15.88 180 top
D194  40.64,18.41 180 top
D195  40.64,20.95 180 top
D196  40.64,23.5 180 top
D197  40.64,26.04 180 top
D198  74.3,6.99 270 top
D199  76.52,6.99 270 top
D200  78.74,6.99 270 top
D201  80.96,6.99 270 top
D202  83.19,6.99 270 top
D203  85.41,6.99 270 top
D204  87.63,6.99 270 top
D205  89.85,6.99 270 top
D206  92.08,6.99 270 top
D207  94.3,6.99 270 top
D208  96.52,6.99 270 top
Q1  71.12,96.2 0 top
Q2  71.12,87.95 0 top
Q3  71.12,79.69 0 top
Q4  71.12,71.44 0 top
Q5  71.12,63.18 0 top
Q6  71.12,54.93 0 top
Q7  71.12,46.67 0 top
Q8  71.12,38.42 0 top
Q9  78.11,96.2 0 top
Q10  77.79,87.95 0 top
Q11  77.79,79.69 0 top
Q12  77.79,71.44 0 top
Q13  77.79,63.18 0 top
Q14  77.79,54.93 0 top
Q15  77.79,46.67 0 top
Q16  77.79,38.42 0 top
R1  64.45,93.03 270 top
R2  48.26,8.26 0 top
R3  64.45,84.77 270 top
R4  48.26,10.79 0 top
R5  48.26,13.34 0 top
R6  48.26,15.88 0 top
R7  48.26,18.41 0 top
R8  48.26,20.95 0 top
R9  48.26,23.5 0 top
R10  48.26,26.04 0 top
R11  55.88,8.26 180 top
R12  55.88,10.79 180 top
R13  55.88,13.34 180 top
R14  55.88,15.88 180 top
R15  55.88,18.41 180 top
R16  55.88,20.95 180 top
R17  55.88,23.5 180 top
R18  55.88,26.04 180 top
R19  64.14,76.52 270 top
R20  64.14,68.26 270 top
R21  64.14,59.69 270 top
R22  64.14,51.75 270 top
R23  64.14,43.5 270 top
R24  64.14,35.24 270 top
R25  66.67,93.03 270 top
R26  66.67,84.77 270 top
R27  66.36,76.52 270 top
R28  66.36,68.26 270 top
R29  66.36,59.69 270 top
R30  66.36,51.75 270 top
R31  66.36,43.5 270 top
R32  66.36,35.24 270 top
VR1  18.1,17.14 0 top

### Tracks (layer width: path | path; a pad name or v marks a point on that pad's centre or on a via)
CARDENABLE  (via drill 0.3)
  Top 0.406: D190.C D191.C D192.C D193.C D194.C D195.C D196.C D197.C | D182.C D183.C D184.C D185.C D186.C D187.C D188.C D189.C
  Top 0.61: D182.C 32.7,6.67 v38.1,6.67 D190.C
  Bottom 0.61: CN34.P$4 42.86,1.91 v38.1,6.67
DB0
  Bottom 0.203: D1.A 5.08,90.81 | 5.08,90.81 5.08,98.22 33.34,98.22 33.34,90.81 | D12.A 5.08,82.23 | 5.08,82.23 5.08,90.81 | D23.A 5.08,73.66 | 5.08,73.66 5.08,82.23 | D34.A 5.08,65.09 | 5.08,65.09 5.08,73.66 | D45.A 5.08,56.52 | 5.08,56.52 5.08,65.09 | D56.A 5.08,47.94 | 5.08,47.94 5.08,56.52 | D67.A 5.08,39.37 | 5.08,39.37 5.08,47.94 | D78.A 5.08,30.8 5.08,39.37 | D89.A 33.34,90.81 | D100.A 33.34,82.23 | 33.34,82.23 33.34,90.81 | D111.A 33.34,73.66 | 33.34,73.66 33.34,82.23 | D122.A 33.34,65.09 | 33.34,65.09 33.34,73.66 | D133.A 33.34,56.52 | 33.34,56.52 33.34,65.09 | D144.A 33.34,47.94 | 33.34,47.94 33.34,56.52 | D155.A 33.34,39.37 | 33.34,39.37 33.34,47.94 | D166.A 33.34,30.8 33.34,39.37 | D78.A 3.77,30.8 | CN0.P$1 2.13,4.85 2.13,27.23 3.76,28.85 3.76,30.75 D78.A
DB1  (via drill 0.3)
  Top 0.203: v7.62,97.59 8.57,98.65 v35.88,98.65
  Bottom 0.203: D2.A 7.62,90.81 | 7.62,90.81 v7.62,97.59 | D13.A 7.62,82.23 | 7.62,82.23 7.62,90.81 | D24.A 7.62,73.66 | 7.62,73.66 7.62,82.23 | D35.A 7.62,65.09 | 7.62,65.09 7.62,73.66 | D46.A 7.62,56.52 | 7.62,56.52 7.62,65.09 | D57.A 7.62,47.94 | 7.62,47.94 7.62,56.52 | D68.A 7.62,39.37 | 7.62,39.37 7.62,47.94 | 7.62,39.37 7.62,30.8 D79.A 2.54,26.99 2.54,5.18 4.57,3.15 6.38,3.15 CN0.P$2 | D90.A 35.88,90.81 | 35.88,90.81 v35.88,98.65 | D101.A 35.88,82.23 | 35.88,82.23 35.88,90.81 | D112.A 35.88,73.66 | 35.88,73.66 35.88,82.23 | D123.A 35.88,65.09 | 35.88,65.09 35.88,73.66 | D134.A 35.88,56.52 | 35.88,56.52 35.88,65.09 | D145.A 35.88,47.94 | 35.88,47.94 35.88,56.52 | D156.A 35.88,39.37 | 35.88,39.37 35.88,47.94 | D167.A 35.88,30.8 35.88,39.37
DB2  (via drill 0.3)
  Top 0.203: v10.16,97.56 10.79,98.27 34.15,98.17 35.17,98.17 35.57,97.77 36.08,97.77 36.49,98.17 38.11,98.17 v38.42,97.87
  Bottom 0.203: D3.A 10.16,90.81 | 10.16,90.81 v10.16,97.56 | D14.A 10.16,82.23 | 10.16,82.23 10.16,90.81 | D25.A 10.16,73.66 | 10.16,73.66 10.16,82.23 | D36.A 10.16,65.09 | 10.16,65.09 10.16,73.66 | D47.A 10.16,56.52 | 10.16,56.52 10.16,65.09 | D58.A 10.16,47.94 | 10.16,47.94 10.16,56.52 | D69.A 10.16,39.37 | 10.16,39.37 10.16,47.94 | 10.16,39.37 10.16,30.8 D80.A 7.66,29.57 5.79,29.57 2.95,26.72 2.95,5.38 4.78,3.56 8.51,3.56 CN0.P$3 | D91.A 38.42,90.81 | 38.42,90.81 v38.42,97.87 | D102.A 38.42,82.23 | 38.42,82.23 38.42,90.81 | D113.A 38.42,73.66 | 38.42,73.66 38.42,82.23 | D124.A 38.42,65.09 | 38.42,65.09 38.42,73.66 | D135.A 38.42,56.52 | 38.42,56.52 38.42,65.09 | D146.A 38.42,47.94 | 38.42,47.94 38.42,56.52 | D157.A 38.42,39.37 | 38.42,39.37 38.42,47.94 | D168.A 38.42,30.8 38.42,39.37
DB3
  Top 0.203: D81.A 11.7,30.8 12.8,29.69 41.12,29.69 D169.A
  Bottom 0.203: D4.A 12.7,90.81 12.7,82.23 | D15.A 12.7,82.23 | D26.A 12.7,73.66 | 12.7,73.66 12.7,82.23 | D37.A 12.7,65.09 | 12.7,65.09 12.7,73.66 | D48.A 12.7,56.52 | 12.7,56.52 12.7,65.09 | D59.A 12.7,47.94 | 12.7,47.94 12.7,56.52 | D70.A 12.7,39.37 | 12.7,39.37 12.7,47.94 | 12.7,39.37 12.7,30.8 D81.A 9.79,29.16 5.99,29.16 3.35,26.52 3.35,5.59 4.98,3.96 10.64,3.96 CN0.P$4 | D92.A 40.96,90.81 40.96,82.23 | D103.A 40.96,82.23 | D114.A 40.96,73.66 | 40.96,73.66 40.96,82.23 | D125.A 40.96,65.09 | 40.96,65.09 40.96,73.66 | D136.A 40.96,56.52 | 40.96,56.52 40.96,65.09 | D147.A 40.96,47.94 | 40.96,47.94 40.96,56.52 | D158.A 40.96,39.37 | 40.96,39.37 40.96,47.94 | D169.A 40.96,30.8 40.96,39.37
DB4
  Top 0.203: D71.A 14.2,39.37 15.24,38.33 43.73,38.33 D159.A
  Bottom 0.203: D5.A 15.24,90.81 15.24,82.23 | D16.A 15.24,82.23 | D27.A 15.24,73.66 | 15.24,73.66 15.24,82.23 | D38.A 15.24,65.09 | 15.24,65.09 15.24,73.66 | D49.A 15.24,56.52 | 15.24,56.52 15.24,65.09 | D60.A 15.24,47.94 | 15.24,47.94 15.24,56.52 | D71.A 15.24,39.37 | 15.24,39.37 15.24,47.94 | 15.24,39.37 15.24,30.8 D82.A 11.93,28.75 6.2,28.75 3.76,26.31 3.76,5.79 5.18,4.37 12.78,4.37 CN0.P$5 | D93.A 43.5,90.81 43.5,82.23 | D104.A 43.5,82.23 | D115.A 43.5,73.66 | 43.5,73.66 43.5,82.23 | D126.A 43.5,65.09 | 43.5,65.09 43.5,73.66 | D137.A 43.5,56.52 | 43.5,56.52 43.5,65.09 | D148.A 43.5,47.94 | 43.5,47.94 43.5,56.52 | D159.A 43.5,39.37 | 43.5,39.37 43.5,47.94 | D170.A 43.5,30.8 43.5,39.37
DB5
  Top 0.203: D61.A 16.9,47.94 17.98,46.86 46.23,46.86 D149.A
  Bottom 0.203: D6.A 17.78,90.81 17.78,82.23 | D17.A 17.78,82.23 | D28.A 17.78,73.66 | 17.78,73.66 17.78,82.23 | D39.A 17.78,65.09 | 17.78,65.09 17.78,73.66 | D50.A 17.78,56.52 | 17.78,56.52 17.78,65.09 | D61.A 17.78,47.94 | 17.78,47.94 17.78,56.52 | D72.A 17.78,39.37 | 17.78,39.37 17.78,47.94 | 17.78,39.37 17.78,30.8 D83.A 14.06,28.35 6.4,28.35 4.17,26.11 4.17,5.99 5.38,4.78 14.91,4.78 CN0.P$6 | D94.A 46.04,90.81 46.04,82.23 | D105.A 46.04,82.23 | D116.A 46.04,73.66 | 46.04,73.66 46.04,82.23 | D127.A 46.04,65.09 | 46.04,65.09 46.04,73.66 | D138.A 46.04,56.52 | 46.04,56.52 46.04,65.09 | D149.A 46.04,47.94 | 46.04,47.94 46.04,56.52 | D160.A 46.04,39.37 | 46.04,39.37 46.04,47.94 | D171.A 46.04,30.8 46.04,39.37
DB6
  Top 0.203: D51.A 19.61,56.52 20.73,55.4 48.73,55.4 D139.A
  Bottom 0.203: D7.A 20.32,90.81 20.32,82.23 | D18.A 20.32,82.23 | D29.A 20.32,73.66 | 20.32,73.66 20.32,82.23 | D40.A 20.32,65.09 | 20.32,65.09 20.32,73.66 | D51.A 20.32,56.52 | 20.32,56.52 20.32,65.09 | D62.A 20.32,47.94 | 20.32,47.94 20.32,56.52 | D73.A 20.32,39.37 | 20.32,39.37 20.32,47.94 | 20.32,39.37 20.32,30.8 D84.A 16.19,27.94 6.6,27.94 4.57,25.91 4.57,6.2 5.59,5.18 17.04,5.18 CN0.P$7 | D95.A 48.58,90.81 48.58,82.23 | D106.A 48.58,82.23 | D117.A 48.58,73.66 | 48.58,73.66 48.58,82.23 | D128.A 48.58,65.09 | 48.58,65.09 48.58,73.66 | D139.A 48.58,56.52 | 48.58,56.52 48.58,65.09 | D150.A 48.58,47.94 | 48.58,47.94 48.58,56.52 | D161.A 48.58,39.37 | 48.58,39.37 48.58,47.94 | D172.A 48.58,30.8 48.58,39.37
DB7
  Top 0.203: D41.A 22.11,65.09 23.16,64.03 51.33,64.03 D129.A
  Bottom 0.203: D8.A 22.86,90.81 22.86,82.23 | D19.A 22.86,82.23 | D30.A 22.86,73.66 | 22.86,73.66 22.86,82.23 | D41.A 22.86,65.09 | 22.86,65.09 22.86,73.66 | D52.A 22.86,56.52 | 22.86,56.52 22.86,65.09 | D63.A 22.86,47.94 | 22.86,47.94 22.86,56.52 | D74.A 22.86,39.37 | 22.86,39.37 22.86,47.94 | 22.86,39.37 22.86,30.8 D85.A 18.33,27.53 6.81,27.53 4.98,25.7 4.98,6.4 5.79,5.59 19.18,5.59 CN0.P$8 | D96.A 51.12,90.81 51.12,82.23 | D107.A 51.12,82.23 | D118.A 51.12,73.66 | 51.12,73.66 51.12,82.23 | D129.A 51.12,65.09 | 51.12,65.09 51.12,73.66 | D140.A 51.12,56.52 | 51.12,56.52 51.12,65.09 | D151.A 51.12,47.94 | 51.12,47.94 51.12,56.52 | D162.A 51.12,39.37 | 51.12,39.37 51.12,47.94 | D173.A 51.12,30.8 51.12,39.37
DB8
  Top 0.203: D31.A 24.82,73.66 25.91,72.57 53.84,72.57 D119.A
  Bottom 0.203: D9.A 25.4,90.81 25.4,82.23 | D20.A 25.4,82.23 | D31.A 25.4,73.66 | 25.4,73.66 25.4,82.23 | D42.A 25.4,65.09 | 25.4,65.09 25.4,73.66 | D53.A 25.4,56.52 | 25.4,56.52 25.4,65.09 | D64.A 25.4,47.94 | 25.4,47.94 25.4,56.52 | D75.A 25.4,39.37 | 25.4,39.37 25.4,47.94 | 25.4,39.37 25.4,30.8 D86.A 20.46,27.13 7.01,27.13 5.38,25.5 5.38,6.6 5.99,5.99 21.31,5.99 CN0.P$9 | D97.A 53.66,90.81 53.66,82.23 | D108.A 53.66,82.23 | D119.A 53.66,73.66 | 53.66,73.66 53.66,82.23 | D130.A 53.66,65.09 | 53.66,65.09 53.66,73.66 | D141.A 53.66,56.52 | 53.66,56.52 53.66,65.09 | D152.A 53.66,47.94 | 53.66,47.94 53.66,56.52 | D163.A 53.66,39.37 | 53.66,39.37 53.66,47.94 | D174.A 53.66,30.8 53.66,39.37
DB9
  Top 0.203: D21.A 26.91,82.23 27.94,81.2 56.44,81.2 D109.A
  Bottom 0.203: D10.A 27.94,90.81 27.94,82.23 | D21.A 27.94,82.23 | D32.A 27.94,73.66 | 27.94,73.66 27.94,82.23 | D43.A 27.94,65.09 | 27.94,65.09 27.94,73.66 | D54.A 27.94,56.52 | 27.94,56.52 27.94,65.09 | D65.A 27.94,47.94 | 27.94,47.94 27.94,56.52 | D76.A 27.94,39.37 | 27.94,39.37 27.94,47.94 | 27.94,39.37 27.94,30.8 D87.A 22.59,26.72 7.21,26.72 5.79,25.3 5.79,6.81 6.2,6.4 23.44,6.4 CN0.P$10 | D98.A 56.2,90.81 56.2,82.23 | D109.A 56.2,82.23 | D120.A 56.2,73.66 | 56.2,73.66 56.2,82.23 | D131.A 56.2,65.09 | 56.2,65.09 56.2,73.66 | D142.A 56.2,56.52 | 56.2,56.52 56.2,65.09 | D153.A 56.2,47.94 | 56.2,47.94 56.2,56.52 | D164.A 56.2,39.37 | 56.2,39.37 56.2,47.94 | D175.A 56.2,30.8 56.2,39.37
DB10
  Top 0.203: D11.A 32.27,90.81 33.34,89.74 58.94,89.74 D99.A
  Bottom 0.203: D11.A 30.48,90.81 30.48,82.23 | D22.A 30.48,82.23 | D33.A 30.48,73.66 | 30.48,73.66 30.48,82.23 | D44.A 30.48,65.09 | 30.48,65.09 30.48,73.66 | D55.A 30.48,56.52 | 30.48,56.52 30.48,65.09 | D66.A 30.48,47.94 | 30.48,47.94 30.48,56.52 | D77.A 30.48,39.37 | 30.48,39.37 30.48,47.94 | 30.48,39.37 30.48,30.8 D88.A 24.73,26.31 7.42,26.31 6.2,25.09 6.2,7.11 6.5,6.81 25.58,6.81 CN0.P$11 | D99.A 58.74,90.81 58.74,82.23 | D110.A 58.74,82.23 | D121.A 58.74,73.66 | 58.74,73.66 58.74,82.23 | D132.A 58.74,65.09 | 58.74,65.09 58.74,73.66 | D143.A 58.74,56.52 | 58.74,56.52 58.74,65.09 | D154.A 58.74,47.94 | 58.74,47.94 58.74,56.52 | D165.A 58.74,39.37 | 58.74,39.37 58.74,47.94 | D176.A 58.74,30.8 58.74,39.37
GND
  pour Top: 0,0 100.33,0 100.33,99.69 0,99.69
N$1
  Bottom 0.203: D1.C CN1.P$1
N$2
  Bottom 0.203: D2.C CN1.P$2
N$3
  Bottom 0.203: D3.C CN1.P$3
N$4
  Bottom 0.203: D4.C CN1.P$4
N$5
  Bottom 0.203: D5.C CN1.P$5
N$6
  Bottom 0.203: D6.C CN1.P$6
N$7
  Bottom 0.203: D7.C CN1.P$7
N$8
  Bottom 0.203: D8.C CN1.P$8
N$9
  Bottom 0.203: D9.C CN1.P$9
N$10
  Bottom 0.203: D10.C CN1.P$10
N$11
  Bottom 0.203: D11.C CN1.P$11
N$12
  Bottom 0.203: D12.C CN3.P$1
N$13
  Bottom 0.203: D13.C CN3.P$2
N$14
  Bottom 0.203: D14.C CN3.P$3
N$15
  Bottom 0.203: D15.C CN3.P$4
N$16
  Bottom 0.203: D16.C CN3.P$5
N$17
  Bottom 0.203: D17.C CN3.P$6
N$18
  Bottom 0.203: D18.C CN3.P$7
N$19
  Bottom 0.203: D19.C CN3.P$8
N$20
  Bottom 0.203: D20.C CN3.P$9
N$21
  Bottom 0.203: D21.C CN3.P$10
N$22
  Bottom 0.203: D22.C CN3.P$11
N$23
  Bottom 0.203: D23.C CN5.P$1
N$24
  Bottom 0.203: D24.C CN5.P$2
N$25
  Bottom 0.203: D25.C CN5.P$3
N$26
  Bottom 0.203: D26.C CN5.P$4
N$27
  Bottom 0.203: D27.C CN5.P$5
N$28
  Bottom 0.203: D28.C CN5.P$6
N$29
  Bottom 0.203: D29.C CN5.P$7
N$30
  Bottom 0.203: D30.C CN5.P$8
N$31
  Bottom 0.203: D31.C CN5.P$9
N$32
  Bottom 0.203: D32.C CN5.P$10
N$33
  Bottom 0.203: D33.C CN5.P$11
N$34
  Bottom 0.203: D34.C CN8.P$1
N$35
  Bottom 0.203: D35.C CN8.P$2
N$36
  Bottom 0.203: D36.C CN8.P$3
N$37
  Bottom 0.203: D37.C CN8.P$4
N$38
  Bottom 0.203: D38.C CN8.P$5
N$39
  Bottom 0.203: D39.C CN8.P$6
N$40
  Bottom 0.203: D40.C CN8.P$7
N$41
  Bottom 0.203: D41.C CN8.P$8
N$42
  Bottom 0.203: D42.C CN8.P$9
N$43
  Bottom 0.203: D43.C CN8.P$10
N$44
  Bottom 0.203: D44.C CN8.P$11
N$45
  Bottom 0.203: D45.C CN7.P$1
N$46
  Bottom 0.203: D46.C CN7.P$2
N$47
  Bottom 0.203: D47.C CN7.P$3
N$48
  Bottom 0.203: D48.C CN7.P$4
N$49
  Bottom 0.203: D49.C CN7.P$5
N$50
  Bottom 0.203: D50.C CN7.P$6
N$51
  Bottom 0.203: D51.C CN7.P$7
N$52
  Bottom 0.203: D52.C CN7.P$8
N$53
  Bottom 0.203: D53.C CN7.P$9
N$54
  Bottom 0.203: D54.C CN7.P$10
N$55
  Bottom 0.203: D55.C CN7.P$11
N$56
  Bottom 0.203: D56.C CN12.P$1
N$57
  Bottom 0.203: D57.C CN12.P$2
N$58
  Bottom 0.203: D58.C CN12.P$3
N$59
  Bottom 0.203: D59.C CN12.P$4
N$60
  Bottom 0.203: D60.C CN12.P$5
N$61
  Bottom 0.203: D61.C CN12.P$6
N$62
  Bottom 0.203: D62.C CN12.P$7
N$63
  Bottom 0.203: D63.C CN12.P$8
N$64
  Bottom 0.203: D64.C CN12.P$9
N$65
  Bottom 0.203: D65.C CN12.P$10
N$66
  Bottom 0.203: D66.C CN12.P$11
N$67
  Bottom 0.203: D67.C CN14.P$1
N$68
  Bottom 0.203: D68.C CN14.P$2
N$69
  Bottom 0.203: D69.C CN14.P$3
N$70
  Bottom 0.203: D70.C CN14.P$4
N$71
  Bottom 0.203: D71.C CN14.P$5
N$72
  Bottom 0.203: D72.C CN14.P$6
N$73
  Bottom 0.203: D73.C CN14.P$7
N$74
  Bottom 0.203: D74.C CN14.P$8
N$75
  Bottom 0.203: D75.C CN14.P$9
N$76
  Bottom 0.203: D76.C CN14.P$10
N$77
  Bottom 0.203: D77.C CN14.P$11
N$78
  Bottom 0.203: D78.C CN16.P$1
N$79
  Bottom 0.203: D79.C CN16.P$2
N$80
  Bottom 0.203: D80.C CN16.P$3
N$81
  Bottom 0.203: D81.C CN16.P$4
N$82
  Bottom 0.203: D82.C CN16.P$5
N$83
  Bottom 0.203: D83.C CN16.P$6
N$84
  Bottom 0.203: D84.C CN16.P$7
N$85
  Bottom 0.203: D85.C CN16.P$8
N$86
  Bottom 0.203: D86.C CN16.P$9
N$87
  Bottom 0.203: D87.C CN16.P$10
N$88
  Bottom 0.203: D88.C CN16.P$11
N$89
  Bottom 0.203: D89.C CN11.P$1
N$90
  Bottom 0.203: D90.C CN11.P$2
N$91
  Bottom 0.203: D91.C CN11.P$3
N$92
  Bottom 0.203: D92.C CN11.P$4
N$93
  Bottom 0.203: D93.C CN11.P$5
N$94
  Bottom 0.203: D94.C CN11.P$6
N$95
  Bottom 0.203: D95.C CN11.P$7
N$96
  Bottom 0.203: D96.C CN11.P$8
N$97
  Bottom 0.203: D97.C CN11.P$9
N$98
  Bottom 0.203: D98.C CN11.P$10
N$99
  Bottom 0.203: D99.C CN11.P$11
N$100
  Bottom 0.203: D100.C CN20.P$1
N$101
  Bottom 0.203: D101.C CN20.P$2
N$102
  Bottom 0.203: D102.C CN20.P$3
N$103
  Bottom 0.203: D103.C CN20.P$4
N$104
  Bottom 0.203: D104.C CN20.P$5
N$105
  Bottom 0.203: D105.C CN20.P$6
N$106
  Bottom 0.203: D106.C CN20.P$7
N$107
  Bottom 0.203: D107.C CN20.P$8
N$108
  Bottom 0.203: D108.C CN20.P$9
N$109
  Bottom 0.203: D109.C CN20.P$10
N$110
  Bottom 0.203: D110.C CN20.P$11
N$111
  Bottom 0.203: D111.C CN22.P$1
N$112
  Bottom 0.203: D112.C CN22.P$2
N$113
  Bottom 0.203: D113.C CN22.P$3
N$114
  Bottom 0.203: D114.C CN22.P$4
N$115
  Bottom 0.203: D115.C CN22.P$5
N$116
  Bottom 0.203: D116.C CN22.P$6
N$117
  Bottom 0.203: D117.C CN22.P$7
N$118
  Bottom 0.203: D118.C CN22.P$8
N$119
  Bottom 0.203: D119.C CN22.P$9
N$120
  Bottom 0.203: D120.C CN22.P$10
N$121
  Bottom 0.203: D121.C CN22.P$11
N$122
  Bottom 0.203: D122.C CN24.P$1
N$123
  Bottom 0.203: D123.C CN24.P$2
N$124
  Bottom 0.203: D124.C CN24.P$3
N$125
  Bottom 0.203: D125.C CN24.P$4
N$126
  Bottom 0.203: D126.C CN24.P$5
N$127
  Bottom 0.203: D127.C CN24.P$6
N$128
  Bottom 0.203: D128.C CN24.P$7
N$129
  Bottom 0.203: D129.C CN24.P$8
N$130
  Bottom 0.203: D130.C CN24.P$9
N$131
  Bottom 0.203: D131.C CN24.P$10
N$132
  Bottom 0.203: D132.C CN24.P$11
N$133
  Bottom 0.203: D133.C CN26.P$1
N$134
  Bottom 0.203: D134.C CN26.P$2
N$135
  Bottom 0.203: D135.C CN26.P$3
N$136
  Bottom 0.203: D136.C CN26.P$4
N$137
  Bottom 0.203: D137.C CN26.P$5
N$138
  Bottom 0.203: D138.C CN26.P$6
N$139
  Bottom 0.203: D139.C CN26.P$7
N$140
  Bottom 0.203: D140.C CN26.P$8
N$141
  Bottom 0.203: D141.C CN26.P$9
N$142
  Bottom 0.203: D142.C CN26.P$10
N$143
  Bottom 0.203: D143.C CN26.P$11
N$144
  Bottom 0.203: D144.C CN28.P$1
N$145
  Bottom 0.203: D145.C CN28.P$2
N$146
  Bottom 0.203: D146.C CN28.P$3
N$147
  Bottom 0.203: D147.C CN28.P$4
N$148
  Bottom 0.203: D148.C CN28.P$5
N$149
  Bottom 0.203: D149.C CN28.P$6
N$150
  Bottom 0.203: D150.C CN28.P$7
N$151
  Bottom 0.203: D151.C CN28.P$8
N$152
  Bottom 0.203: D152.C CN28.P$9
N$153
  Bottom 0.203: D153.C CN28.P$10
N$154
  Bottom 0.203: D154.C CN28.P$11
N$155
  Bottom 0.203: D155.C CN30.P$1
N$156
  Bottom 0.203: D156.C CN30.P$2
N$157
  Bottom 0.203: D157.C CN30.P$3
N$158
  Bottom 0.203: D158.C CN30.P$4
N$159
  Bottom 0.203: D159.C CN30.P$5
N$160
  Bottom 0.203: D160.C CN30.P$6
N$161
  Bottom 0.203: D161.C CN30.P$7
N$162
  Bottom 0.203: D162.C CN30.P$8
N$163
  Bottom 0.203: D163.C CN30.P$9
N$164
  Bottom 0.203: D164.C CN30.P$10
N$165
  Bottom 0.203: D165.C CN30.P$11
N$166
  Bottom 0.203: D166.C CN32.P$1
N$167
  Bottom 0.203: D167.C CN32.P$2
N$168
  Bottom 0.203: D168.C CN32.P$3
N$169
  Bottom 0.203: D169.C CN32.P$4
N$170
  Bottom 0.203: D170.C CN32.P$5
N$171
  Bottom 0.203: D171.C CN32.P$6
N$172
  Bottom 0.203: D172.C CN32.P$7
N$173
  Bottom 0.203: D173.C CN32.P$8
N$174
  Bottom 0.203: D174.C CN32.P$9
N$175
  Bottom 0.203: D175.C CN32.P$10
N$176
  Bottom 0.203: D176.C CN32.P$11
POW
  Bottom 0.61: VR1.IN@1 VR1.IN@2 23.5,10.79 29.84,4.45 38.1,4.45 CN34.P$3
RE0  (via drill 0.3)  (2 unrouted)
  Bottom 0.203: 60.64,26.04 R18.1 58.1,26.99 44.13,26.99 D197.A
  other vias: 62.23,26.04
RE1  (via drill 0.3)  (2 unrouted)
  Bottom 0.203: D196.A 44.13,24.45 58.1,24.45 R17.1 60.64,23.5
  other vias: 62.55,23.5
RE2  (via drill 0.3)  (2 unrouted)
  Bottom 0.203: D195.A 44.13,21.91 58.1,21.91 R16.1 60.64,20.95
  other vias: 62.87,20.95
RE3  (via drill 0.3)  (2 unrouted)
  Bottom 0.203: D194.A 44.13,19.37 58.1,19.37 R15.1 60.64,18.41
  other vias: 62.23,18.41
RE4  (via drill 0.3)  (2 unrouted)
  Bottom 0.203: D193.A 44.13,16.83 58.1,16.83 R14.1 60.64,15.88
  other vias: 61.59,15.88
RE5  (via drill 0.3)  (2 unrouted)
  Bottom 0.203: D192.A 44.13,14.29 58.1,14.29 R13.1 60.64,13.34
  other vias: 61.91,13.65
RE6  (via drill 0.3)  (2 unrouted)
  Bottom 0.203: D191.A 44.13,11.75 58.1,11.75 R12.1 60.64,10.79
  other vias: 61.59,11.11
RE7  (via drill 0.3)  (2 unrouted)
  Bottom 0.203: D190.A 44.13,9.21 58.1,9.21 R11.1 60.64,8.26
  other vias: 61.59,8.57
RE8  (via drill 0.3)  (2 unrouted)
  Bottom 0.203: D189.A 37.15,25.08 44.13,25.08 R10.1 46.04,25.08 60.64,25.08
  other vias: 61.91,25.08
RE9  (via drill 0.3)  (2 unrouted)
  Bottom 0.203: D188.A 37.15,22.54 44.13,22.54 R9.1 46.04,22.54 60.33,22.54
  other vias: 61.59,22.54
RE10  (via drill 0.3)  (2 unrouted)
  Bottom 0.203: D187.A 37.15,20 44.13,20 R8.1 46.04,20 60.64,20
  other vias: 61.28,19.68
RE11  (via drill 0.3)  (2 unrouted)
  Bottom 0.203: D186.A 37.15,17.46 44.13,17.46 R7.1 46.04,17.46 60.64,17.46
  other vias: 62.23,17.46
RE12  (via drill 0.3)  (2 unrouted)
  Bottom 0.203: D185.A 37.15,14.92 44.13,14.92 R6.1 46.04,14.92 60.64,14.92
  other vias: 61.91,14.92
RE13  (via drill 0.3)  (2 unrouted)
  Bottom 0.203: D184.A 37.15,12.38 44.13,12.38 R5.1 46.04,12.38 60.64,12.38
  other vias: 61.91,12.38
RE14  (via drill 0.3)  (2 unrouted)
  Bottom 0.203: D183.A 37.15,9.84 44.13,9.84 R4.1 46.04,9.84 60.64,9.84
  other vias: 61.91,9.84
RE15  (via drill 0.3)  (2 unrouted)
  Bottom 0.203: D182.A 37.15,7.3 44.13,7.3 R2.1 46.04,7.3 60.64,7.3
  other vias: 61.91,7.3
ROW0  (2 unrouted)
  Top 0.305: CN2.P$1 CN2.P$2 CN2.P$3 CN2.P$4 CN2.P$5 CN2.P$6 CN2.P$7 CN2.P$8 CN2.P$9 CN2.P$10 CN2.P$11 32.07,92.71 33.34,93.98 61.91,93.98
ROW1  (2 unrouted)
  Top 0.305: CN4.P$1 CN4.P$2 CN4.P$3 CN4.P$4 CN4.P$5 CN4.P$6 CN4.P$7 CN4.P$8 CN4.P$9 CN4.P$10 CN4.P$11 32.07,84.14 33.34,85.41 61.91,85.41
ROW2  (2 unrouted)
  Top 0.305: CN6.P$1 CN6.P$2 CN6.P$3 CN6.P$4 CN6.P$5 CN6.P$6 CN6.P$7 CN6.P$8 CN6.P$9 CN6.P$10 CN6.P$11 32.07,75.56 33.34,76.83 61.91,76.83
ROW3  (2 unrouted)
  Top 0.305: CN9.P$1 CN9.P$2 CN9.P$3 CN9.P$4 CN9.P$5 CN9.P$6 CN9.P$7 CN9.P$8 CN9.P$9 CN9.P$10 CN9.P$11 32.07,66.99 33.34,68.26 61.91,68.26
ROW4  (2 unrouted)
  Top 0.305: CN10.P$1 CN10.P$2 CN10.P$3 CN10.P$4 CN10.P$5 CN10.P$6 CN10.P$7 CN10.P$8 CN10.P$9 CN10.P$10 CN10.P$11 32.07,58.42 33.34,59.69 61.91,59.69
ROW5  (2 unrouted)
  Top 0.305: CN13.P$1 CN13.P$2 CN13.P$3 CN13.P$4 CN13.P$5 CN13.P$6 CN13.P$7 CN13.P$8 CN13.P$9 CN13.P$10 CN13.P$11 32.07,49.85 33.34,51.12 61.91,51.12
ROW6  (2 unrouted)
  Top 0.305: CN15.P$1 CN15.P$2 CN15.P$3 CN15.P$4 CN15.P$5 CN15.P$6 CN15.P$7 CN15.P$8 CN15.P$9 CN15.P$10 CN15.P$11 32.07,41.27 33.34,42.55 61.91,42.55
ROW7  (2 unrouted)
  Top 0.203: CN17.P$10 CN17.P$11
  Top 0.305: CN17.P$1 CN17.P$2 CN17.P$3 CN17.P$4 CN17.P$5 CN17.P$6 CN17.P$7 CN17.P$8 CN17.P$9 CN17.P$10 | CN17.P$11 32.07,32.7 33.34,33.97 61.91,33.97
ROW8  (2 unrouted)
  Top 0.305: CN18.P$1 CN18.P$2 CN18.P$3 CN18.P$4 CN18.P$5 CN18.P$6 CN18.P$7 CN18.P$8 CN18.P$9 CN18.P$10 CN18.P$11
ROW9  (2 unrouted)
  Top 0.305: CN21.P$1 CN21.P$2 CN21.P$3 CN21.P$4 CN21.P$5 CN21.P$6 CN21.P$7 CN21.P$8 CN21.P$9 CN21.P$10 CN21.P$11
ROW10  (2 unrouted)
  Top 0.203: CN23.P$3 CN23.P$4
  Top 0.305: CN23.P$1 CN23.P$2 CN23.P$3 | CN23.P$4 CN23.P$5 CN23.P$6 CN23.P$7 CN23.P$8 CN23.P$9 CN23.P$10 CN23.P$11
ROW11  (2 unrouted)
  Top 0.305: CN25.P$1 CN25.P$2 CN25.P$3 CN25.P$4 CN25.P$5 CN25.P$6 CN25.P$7 CN25.P$8 CN25.P$9 CN25.P$10 CN25.P$11
ROW12  (2 unrouted)
  Top 0.305: CN27.P$1 CN27.P$2 CN27.P$3 CN27.P$4 CN27.P$5 CN27.P$6 CN27.P$7 CN27.P$8 CN27.P$9 CN27.P$10 CN27.P$11
ROW13  (2 unrouted)
  Top 0.305: CN29.P$1 CN29.P$2 CN29.P$3 CN29.P$4 CN29.P$5 CN29.P$6 CN29.P$7 CN29.P$8 CN29.P$9 CN29.P$10 CN29.P$11
ROW14  (2 unrouted)
  Top 0.305: CN31.P$1 CN31.P$2 CN31.P$3 CN31.P$4 CN31.P$5 CN31.P$6 CN31.P$7 CN31.P$8 CN31.P$9 CN31.P$10 CN31.P$11
ROW15  (2 unrouted)
  Top 0.203: CN33.P$5 CN33.P$6 | CN33.P$9 CN33.P$10
  Top 0.305: CN33.P$1 CN33.P$2 CN33.P$3 CN33.P$4 CN33.P$5 | CN33.P$6 CN33.P$7 CN33.P$8 CN33.P$9 | CN33.P$10 CN33.P$11
SEL0
  Bottom 0.203: D177.C 60.96,4.45 CN19.P$1
SEL1
  Bottom 0.203: D178.C 65.09,4.45 63.82,3.17 62.23,3.17 CN19.P$2
SEL2
  Bottom 0.203: D179.C 66.36,3.17 64.77,3.17 CN19.P$3
SEL3
  Bottom 0.203: D180.C 69.85,4.13 68.9,3.17 67.31,3.17 CN19.P$4
SEL4
  Bottom 0.203: D181.C 72.07,4.13 71.12,3.17 69.85,3.17 CN19.P$5
SEL5
  Bottom 0.203: D198.C 73.66,4.45 CN19.P$6
SEL6
  Bottom 0.203: D199.C 76.2,4.45 CN19.P$7
SEL7
  Bottom 0.203: D200.C CN19.P$8
SEL8
  Bottom 0.203: D201.C 80.96,4.13 CN19.P$9
SEL9
  Bottom 0.203: D202.C 83.19,3.81 CN19.P$10
SEL10
  Bottom 0.203: D203.C 85.41,3.49 CN19.P$11
SEL11
  Bottom 0.203: D204.C 87.63,3.17 CN19.P$12
SEL12
  Bottom 0.203: D205.C 89.85,2.86 CN19.P$13
SEL13
  Bottom 0.203: D206.C 92.08,2.54 CN19.P$14
SEL14
  Bottom 0.203: D207.C 94.3,2.22 CN19.P$15
SEL15
  Bottom 0.203: D208.C CN19.P$16
V+  (18 unrouted)
  Top 0.406: R10.2 R9.2 R8.2 R7.2 R6.2 R5.2 R4.2 R2.2 | R11.2 R12.2 R13.2 R14.2 R15.2 R16.2 R17.2 R18.2
  Bottom 0.61: VR1.OUT@2 VR1.OUT@1

### Text on the board
tPlace: 0 | 8 | 1 | 9 | 2 | A | 3 | B | 4 | C | Rev1 | 5 | D | 6 | E | 7 | F | SmallRoomLabs | AYTABTU 16 WORD ROM | GND | DB10 | DB9 | DB8 | DB7 | DB6 | DB5 | DB4 | DB3 | DB2 | DB1 | DB0 | V+ | CARDSEL | 15 | 0